# EAGLE design LINUX_ARC at (EAGLE 9.6.2)
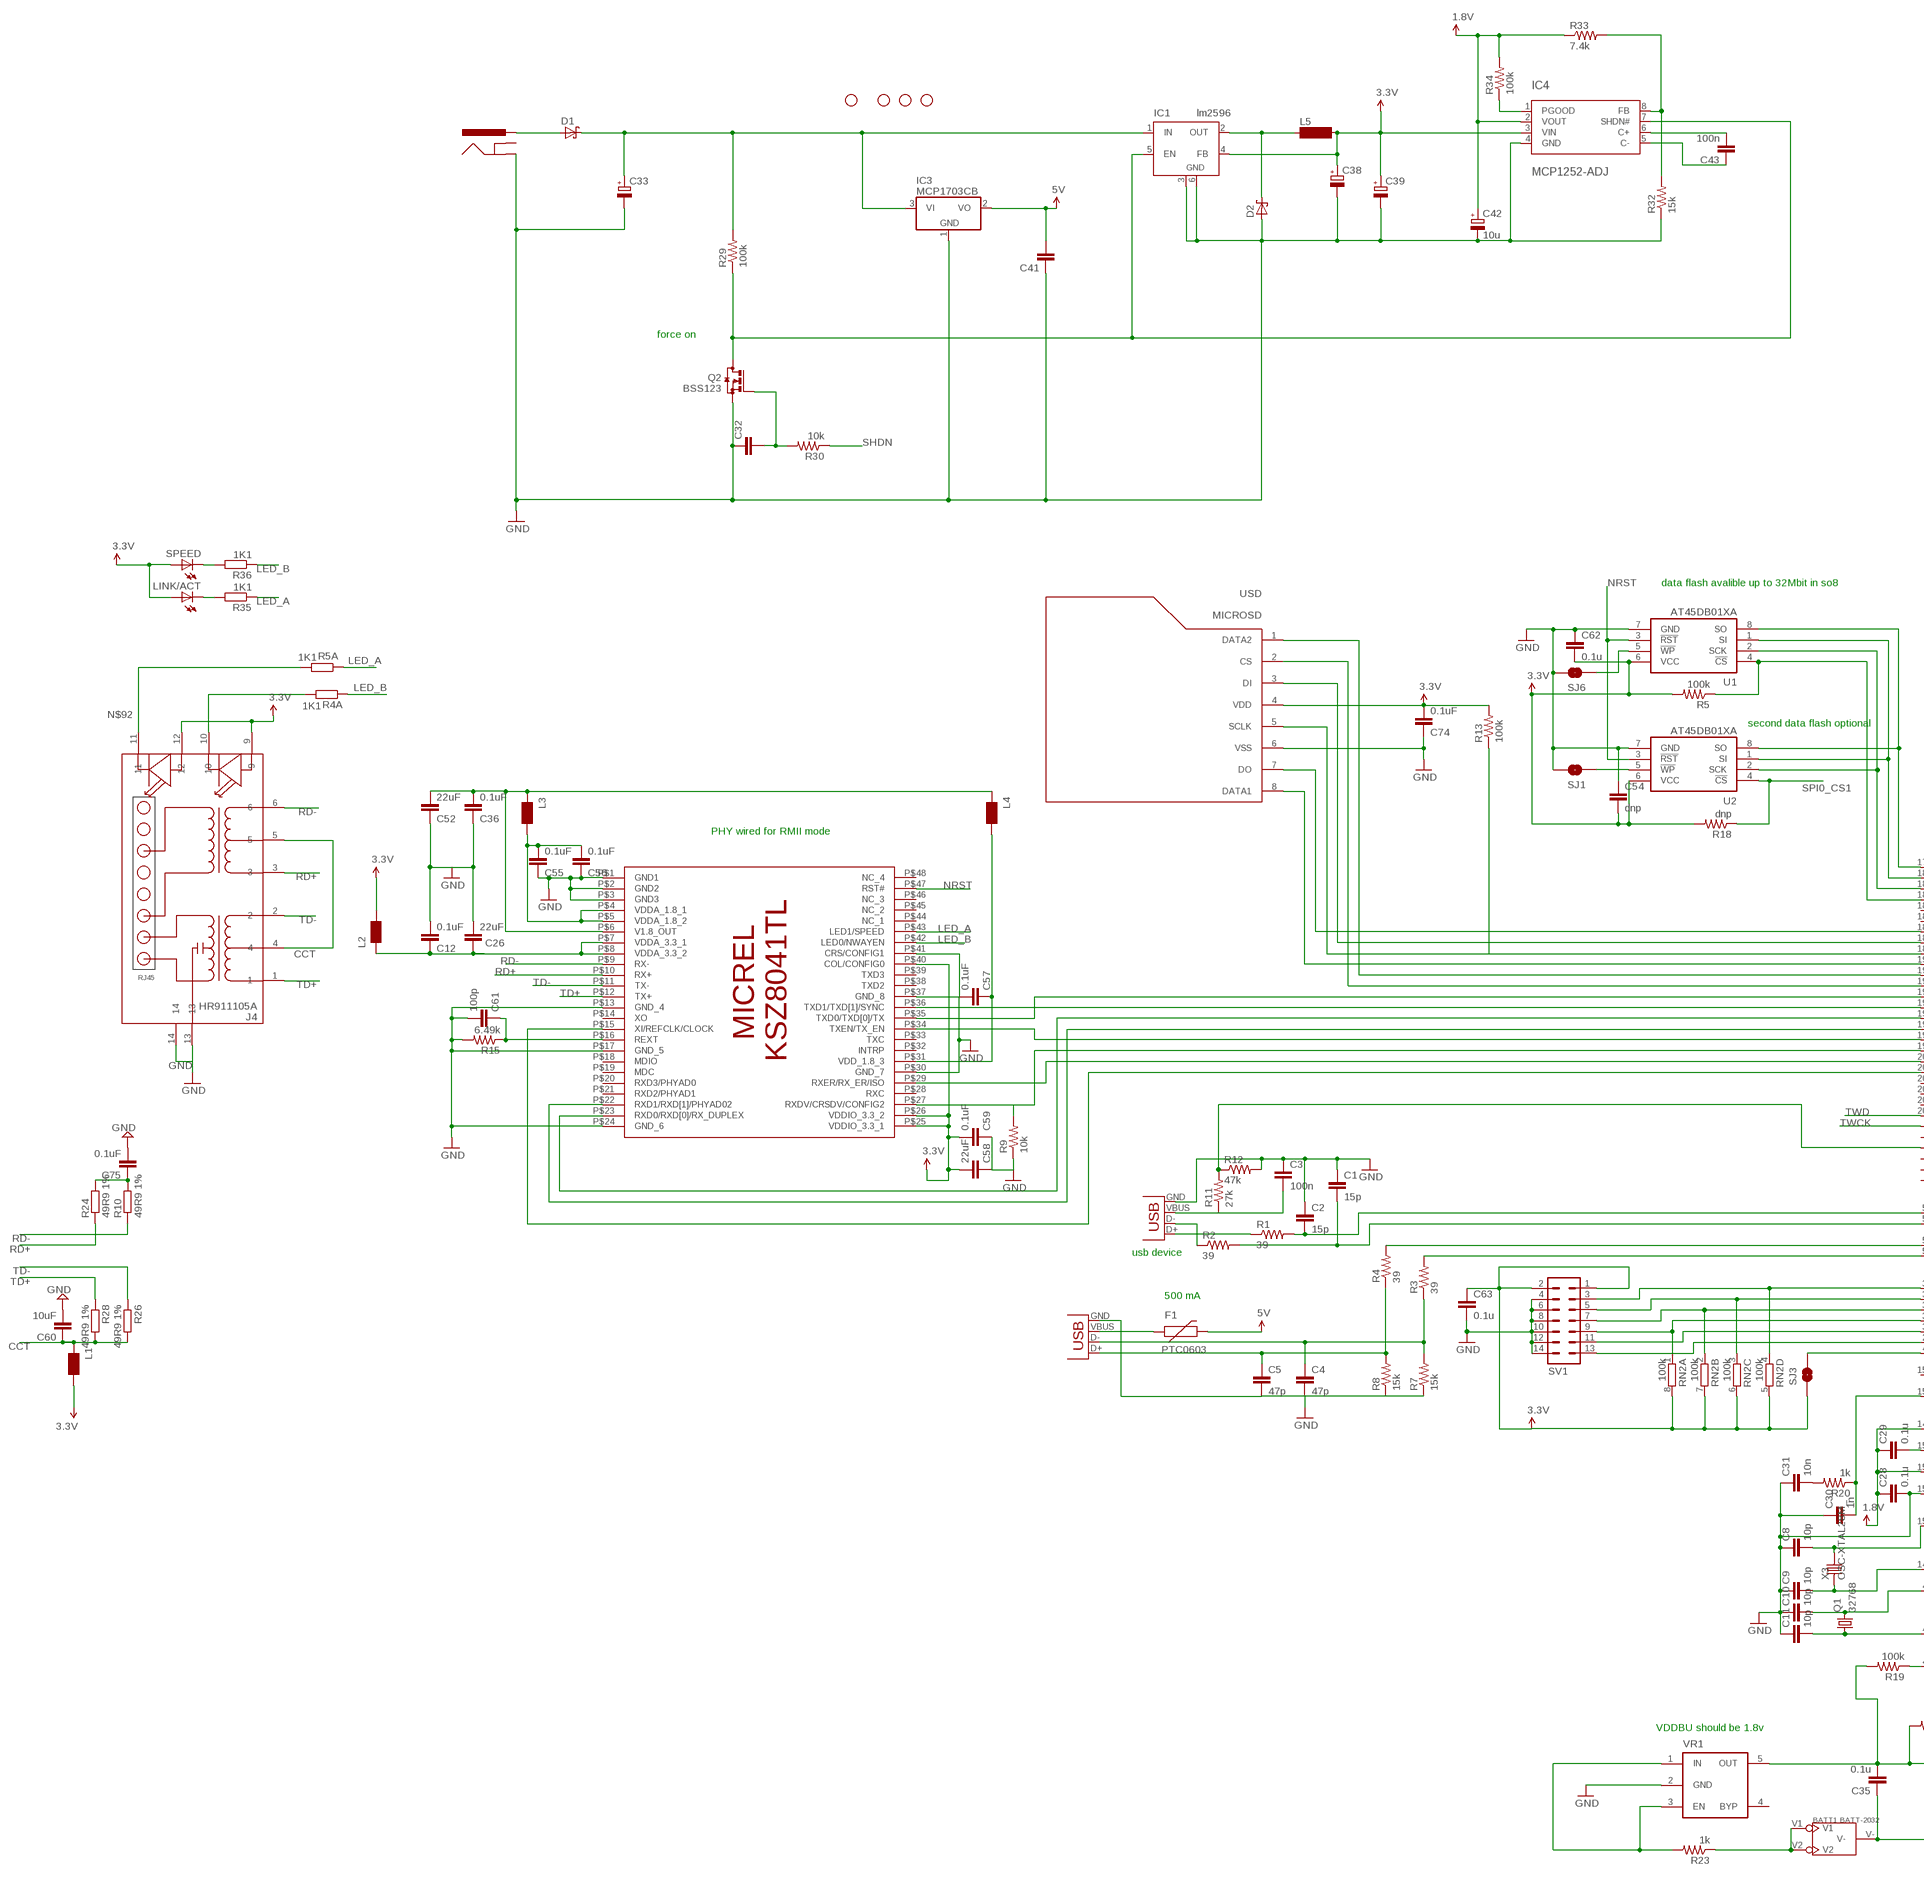
[diagram p0: schematic, sheet 1, part 1 of 2]
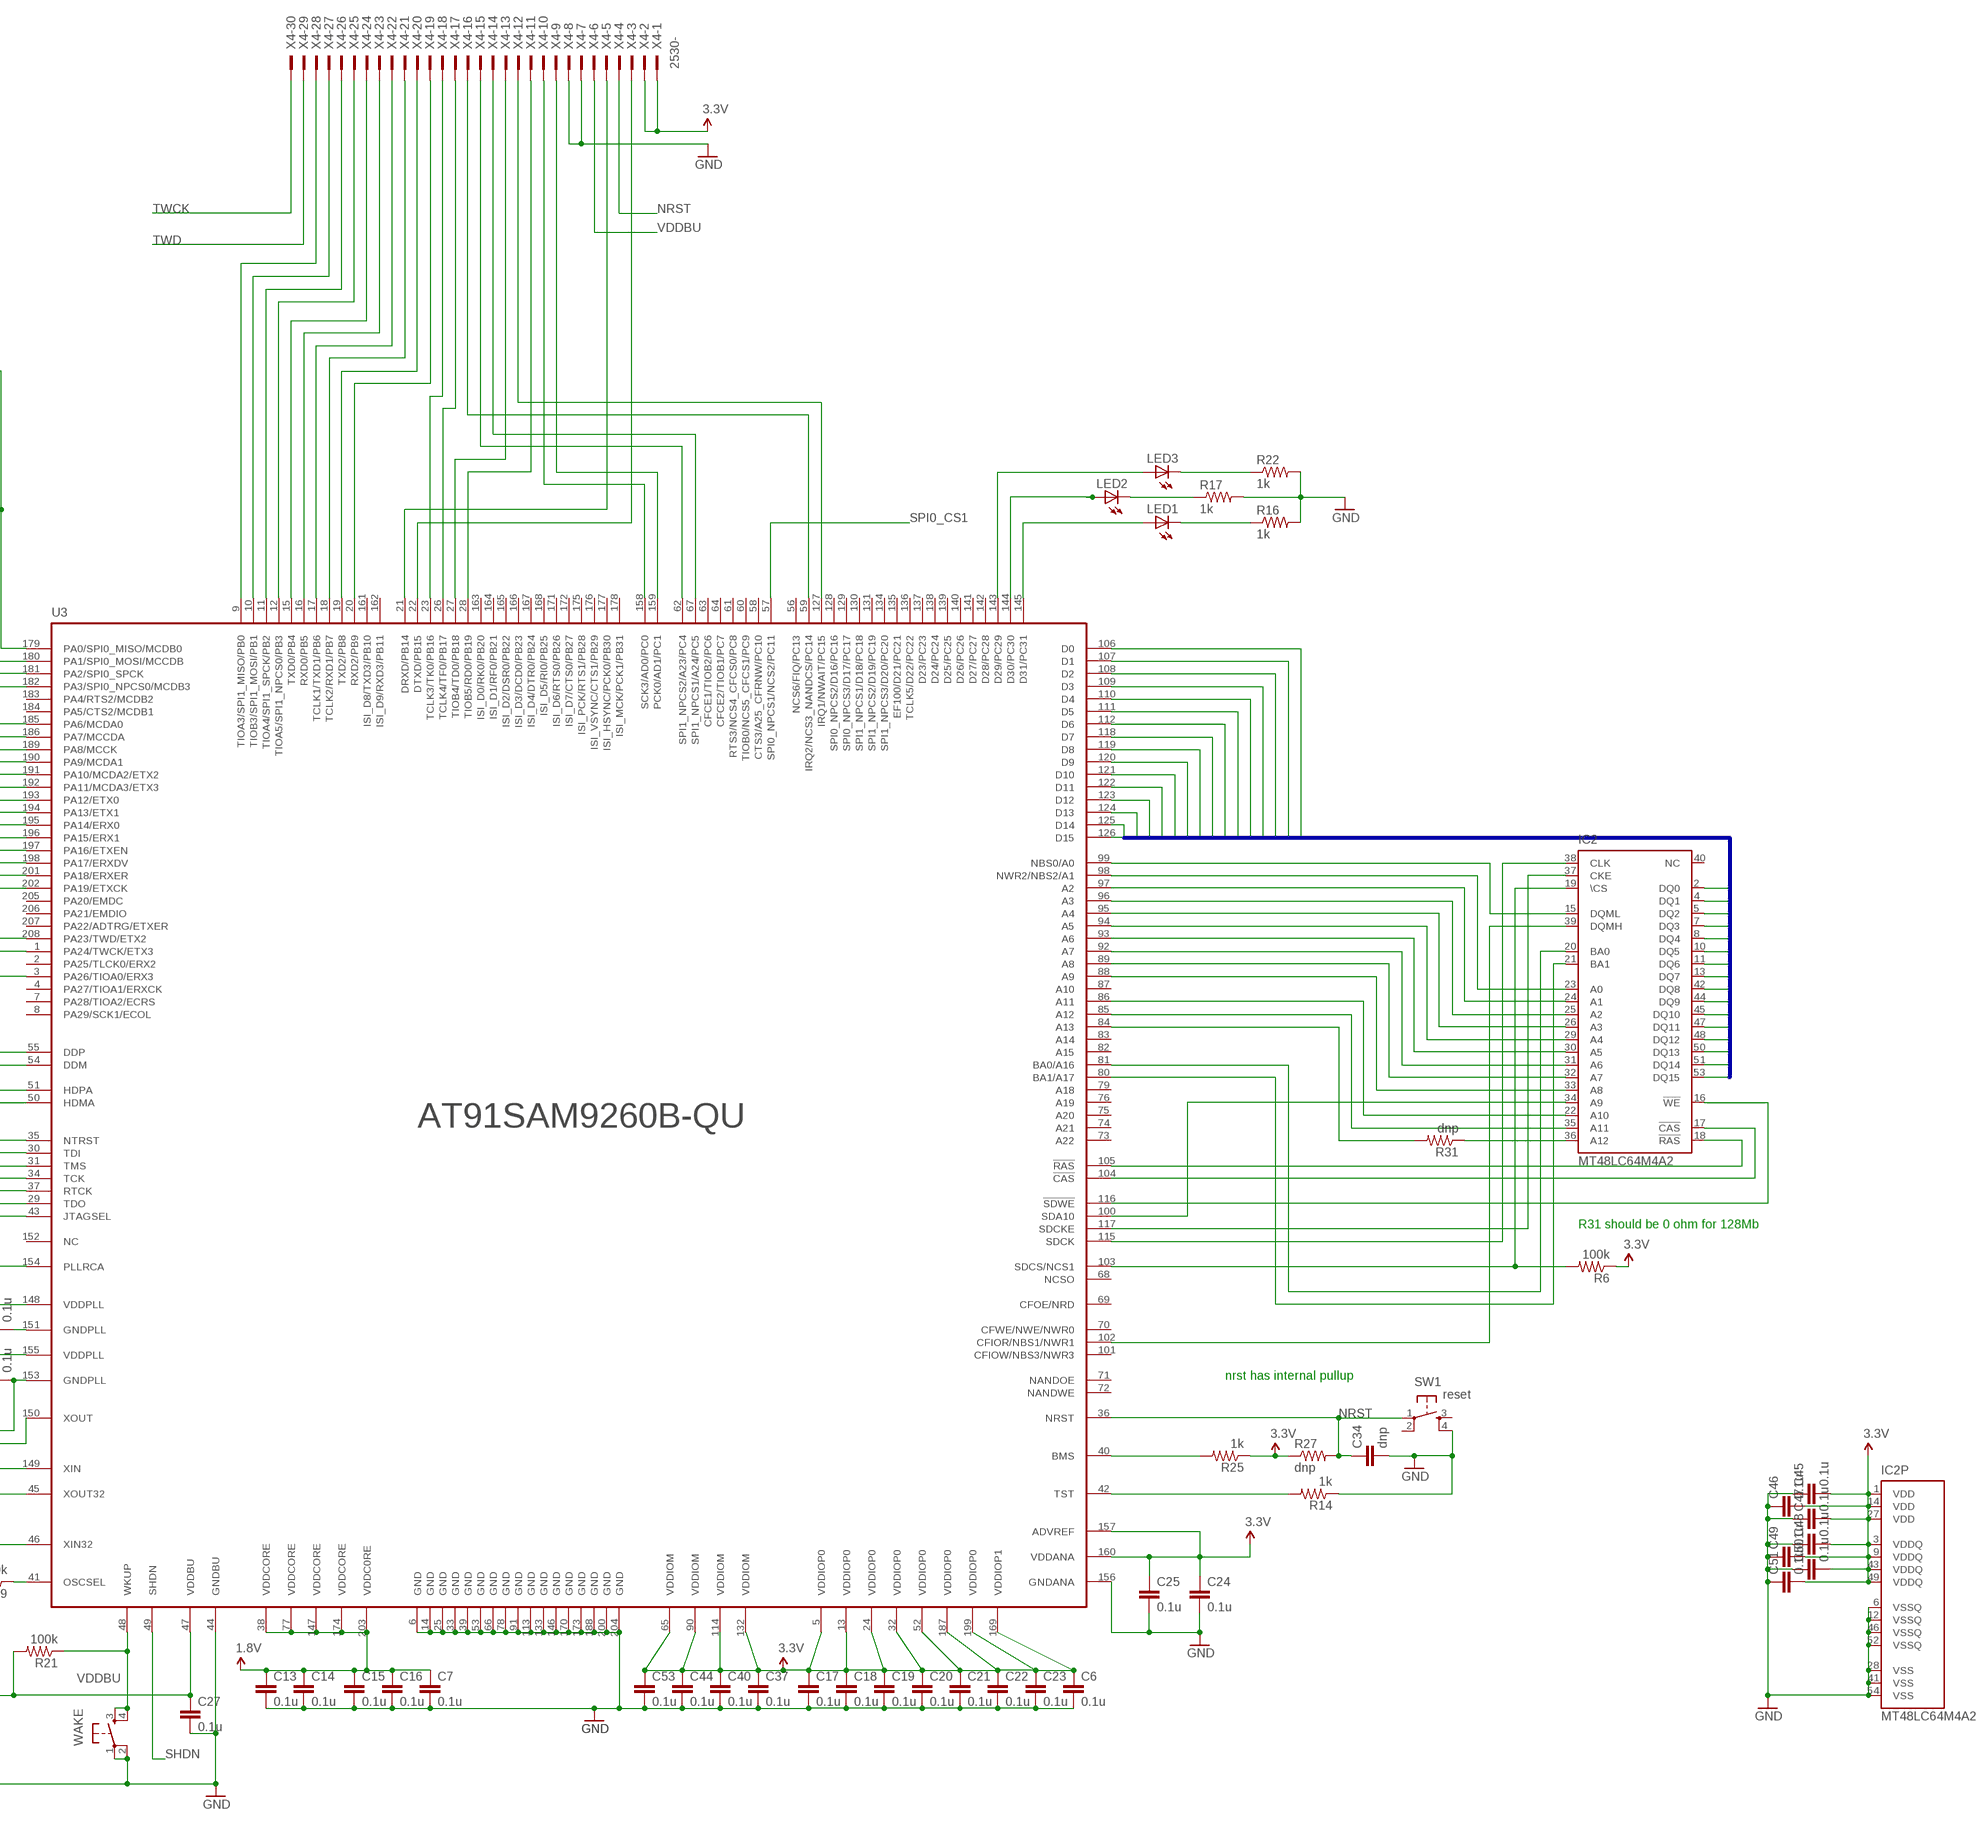
[diagram p1: schematic, sheet 1, part 2 of 2]

## Parts
BATT1  BATT-2032  [2032]
C1  15p  CAP0603-CAP  [0603-CAP]
C2  15p  CAP0603-CAP  [0603-CAP]
C3  100n  CAP0603-CAP  [0603-CAP]
C4  47p  CAP0603-CAP  [0603-CAP]
C5  47p  CAP0603-CAP  [0603-CAP]
C6  0.1u  CAP0603-CAP  [0603-CAP]
C7  0.1u  CAP0603-CAP  [0603-CAP]
C8  10p  CAP0603-CAP  [0603-CAP]
C9  10p  CAP0603-CAP  [0603-CAP]
C10  10p  CAP0603-CAP  [0603-CAP]
C11  10p  CAP0603-CAP  [0603-CAP]
C12  0.1uF  C-EUC0603  [C0603]
C13  0.1u  CAP0603-CAP  [0603-CAP]
C14  0.1u  CAP0603-CAP  [0603-CAP]
C15  0.1u  CAP0603-CAP  [0603-CAP]
C16  0.1u  CAP0603-CAP  [0603-CAP]
C17  0.1u  CAP0603-CAP  [0603-CAP]
C18  0.1u  CAP0603-CAP  [0603-CAP]
C19  0.1u  CAP0603-CAP  [0603-CAP]
C20  0.1u  CAP0603-CAP  [0603-CAP]
C21  0.1u  CAP0603-CAP  [0603-CAP]
C22  0.1u  CAP0603-CAP  [0603-CAP]
C23  0.1u  CAP0603-CAP  [0603-CAP]
C24  0.1u  CAP0603-CAP  [0603-CAP]
C25  0.1u  CAP0603-CAP  [0603-CAP]
C26  22uF  C-EUC0603  [C0603]
C27  0.1u  CAP0603-CAP  [0603-CAP]
C28  0.1u  CAP0603-CAP  [0603-CAP]
C29  0.1u  CAP0603-CAP  [0603-CAP]
C30  1n  CAP0603-CAP  [0603-CAP]
C31  10n  CAP0603-CAP  [0603-CAP]
C32  CAPC603  [C603]
C33  CAP_POLSMC_B  [SMC_B]
C34  dnp  CAP0603-CAP  [0603-CAP]
C35  0.1u  CAP0603-CAP  [0603-CAP]
C36  0.1uF  C-EUC0603  [C0603]
C37  0.1u  CAP0603-CAP  [0603-CAP]
C38  CAP_POLCASE_A  [CASE_A]
C39  CAP_POLSMC_B  [SMC_B]
C40  0.1u  CAP0603-CAP  [0603-CAP]
C41  CAPC603  [C603]
C42  10u  CAP_POLSMC_B  [SMC_B]
C43  100n  CAPC603  [C603]
C44  0.1u  CAP0603-CAP  [0603-CAP]
C45  0.1u  CAP0603-CAP  [0603-CAP]
C46  0.1u  CAP0603-CAP  [0603-CAP]
C47  0.1u  CAP0603-CAP  [0603-CAP]
C48  0.1u  CAP0603-CAP  [0603-CAP]
C49  0.1u  CAP0603-CAP  [0603-CAP]
C50  0.1u  CAP0603-CAP  [0603-CAP]
C51  0.1u  CAP0603-CAP  [0603-CAP]
C52  22uF  C-EUC0603  [C0603]
C53  0.1u  CAP0603-CAP  [0603-CAP]
C54  dnp  CAP0603-CAP  [0603-CAP]
C55  0.1uF  C-EUC0603  [C0603]
C56  0.1uF  C-EUC0603  [C0603]
C57  0.1uF  C-EUC0603  [C0603]
C58  22uF  C-EUC0603  [C0603]
C59  0.1uF  C-EUC0603  [C0603]
C60  10uF  C-EUC0603  [C0603]
C61  100p  C-EUC0603  [C0603]
C62  0.1u  CAP0603-CAP  [0603-CAP]
C63  0.1u  CAP0603-CAP  [0603-CAP]
C74  0.1uF  C-EUC0603  [C0603]
C75  0.1uF  C-EUC0603  [C0603]
D1  SCHOTTKY-DIODESMD  [SMB]
D2  SCHOTTKY-DIODESMD  [SMB]
F1  PTC0603  [0603]
IC1  lm2596  LM2596S  [TO263-5]
IC2  MT48LC64M4A2  [TSOP54-400]
IC3  MCP1703CB  [SOT23]
IC4  MCP1252-ADJ  [MSOP8]
J4  HR911105A  [HR911105A]
JP1  STAND-OFF  [STAND-OFF]
JP2  STAND-OFF  [STAND-OFF]
JP3  STAND-OFF  [STAND-OFF]
JP4  STAND-OFF  [STAND-OFF]
L1  WE-KIL_0805  [WE-KI_0805_B]
L2  WE-KIL_0805  [WE-KI_0805_B]
L3  WE-KIL_0805  [WE-KI_0805_B]
L4  WE-KIL_0805  [WE-KI_0805_B]
L5  MS85  [MS85]
LED1  LEDCHIPLED_0805  [CHIPLED_0805]
LED2  LEDCHIPLED_0805  [CHIPLED_0805]
LED3  LEDCHIPLED_0805  [CHIPLED_0805]
LINK/ACT  LEDCHIPLED_0805  [CHIPLED_0805]
Q1  32768  CRYSTALTC26H  [TC26H]
Q2  BSS123  [SOT23]
R1  39  R-US_R0603  [R0603]
R2  39  R-US_R0603  [R0603]
R3  39  R-US_R0603  [R0603]
R4  39  R-US_R0603  [R0603]
R4A  1K1  R-EU_R0603  [R0603]
R5  100k  R-US_R0603  [R0603]
R5A  1K1  R-EU_R0603  [R0603]
R6  100k  R-US_R0603  [R0603]
R7  15k  R-US_R0603  [R0603]
R8  15k  R-US_R0603  [R0603]
R9  10k  R-US_R0603  [R0603]
R10  49R9 1%  R-EU_R0603  [R0603]
R11  27k  R-US_R0603  [R0603]
R12  47k  R-US_R0603  [R0603]
R13  100k  R-US_R0603  [R0603]
R14  1k  R-US_R0603  [R0603]
R15  6.49k  R-US_R0603  [R0603]
R16  1k  R-US_R0603  [R0603]
R17  1k  R-US_R0603  [R0603]
R18  dnp  R-US_R0603  [R0603]
R19  100k  R-US_R0603  [R0603]
R20  1k  R-US_R0603  [R0603]
R21  100k  R-US_R0603  [R0603]
R22  1k  R-US_R0603  [R0603]
R23  1k  R-US_R0603  [R0603]
R24  49R9 1%  R-EU_R0603  [R0603]
R25  1k  R-US_R0603  [R0603]
R26  49R9 1%  R-EU_R0603  [R0603]
R27  dnp  R-US_R0603  [R0603]
R28  49R9 1%  R-EU_R0603  [R0603]
R29  100k  R-US_R0603  [R0603]
R30  10k  R-US_R0603  [R0603]
R31  dnp  R-US_R0603  [R0603]
R32  15k  R-US_R0603  [R0603]
R33  7.4k  R-US_R0603  [R0603]
R34  100k  R-US_R0603  [R0603]
R35  1K1  R-EU_R0603  [R0603]
R36  1K1  R-EU_R0603  [R0603]
RN2  100k  RNETWORK  [RN8P-4R-CRA06S]
SJ1  SOLDERJUMPERNO  [SJ_2S-NO]
SJ3  SOLDERJUMPERNO  [SJ_2S-NO]
SJ6  SOLDERJUMPERNO  [SJ_2S-NO]
SPEED  LEDCHIPLED_0805  [CHIPLED_0805]
SV1  MA07-2  [MA07-2]
SW1  reset  SW-SMD-SMALL  [TACT_SWITCH_SMALL]
U1  AT45DB01XA  [SO08W]
U2  AT45DB01XA  [SO08W]
U3  AT91SAM9260B-QU  [PQFP208]
U$1  KSZ8041TL  [48PIN-TQFN]
U$2  POWER_JACKSMD  [POWER_JACK_SMD]
USD  MICROSD  [MICROSD]
VR1  MIC5205  [SOT-23-5]
WAKE  SW-SMD-SMALL  [TACT_SWITCH_SMALL]
X1  USB-MB-S  [USB-MB-S]
X2  USB-A-H  [USB-A-H]
X3  OSC-XTAL28M_  [5X8]
X4  2530-  [PAK100/2500-30]

## Nets
1.8V: C7.1 C13.1 C14.1 C15.1 C16.1 C28.1 C29.1 C42.+ R33.1 R34.2 U3.38(VDDCORE) U3.77(VDDCORE) U3.147(VDDCORE) U3.148(VDDPLL) U3.155(VDDPLL) U3.174(VDDCORE) U3.203(VDDC0RE)
3.3V: C6.1 C17.1 C18.1 C19.1 C20.1 C21.1 C22.1 C23.1 C24.1 C25.1 C37.1 C38.+ C39.+ C40.1 C44.1 C45.2 C46.2 C47.2 C48.2 C49.2 C50.2 C51.2 C53.1 C54.2 C58.1 C59.1 C62.2 C63.1 C74.1 IC1.4(FB) IC2.1(VDD) IC2.3(VDDQ) IC2.9(VDDQ) IC2.14(VDD) IC2.27(VDD) IC2.43(VDDQ) IC2.49(VDDQ) IC4.3(VIN) J4.9 J4.12 L1.1 L2.1 L5.2 LINK/ACT.A R5.2 R6.1 R13.2 R18.2 R25.1 R27.1 RN2.5 RN2.6 RN2.7 RN2.8 SJ3.1 SPEED.A SV1.1 SV1.2 U1.6(VCC) U2.6(VCC) U3.5(VDDIOP0) U3.13(VDDIOP0) U3.24(VDDIOP0) U3.32(VDDIOP0) U3.52(VDDIOP0) U3.65(VDDIOM) U3.90(VDDIOM) U3.114(VDDIOM) U3.132(VDDIOM) U3.157(ADVREF) U3.160(VDDANA) U3.169(VDDIOP1) U3.187(VDDIOP0) U3.199(VDDIOP0) U$1.P$25(VDDIO_3.3_1) U$1.P$26(VDDIO_3.3_2) U$1.P$40(COL/CONFIG0) USD.4(VDD) X4.1 X4.2
5V: C41.2 F1.2 IC3.2(VO)
CCT: C60.1 J4.4 J4.5 L1.2 R26.2 R28.2
D0: IC2.2(DQ0) U3.106(D0)
D1: IC2.4(DQ1) U3.107(D1)
D2: IC2.5(DQ2) U3.108(D2)
D3: IC2.7(DQ3) U3.109(D3)
D4: IC2.8(DQ4) U3.110(D4)
D5: IC2.10(DQ5) U3.111(D5)
D6: IC2.11(DQ6) U3.112(D6)
D7: IC2.13(DQ7) U3.118(D7)
D8: IC2.42(DQ8) U3.119(D8)
D9: IC2.44(DQ9) U3.120(D9)
D10: IC2.45(DQ10) U3.121(D10)
D11: IC2.47(DQ11) U3.122(D11)
D12: IC2.48(DQ12) U3.123(D12)
D13: IC2.50(DQ13) U3.124(D13)
D14: IC2.51(DQ14) U3.125(D14)
D15: IC2.53(DQ15) U3.126(D15)
GND: BATT1.V- C1.1 C2.1 C3.1 C4.2 C5.2 C6.2 C7.2 C8.1 C9.1 C10.1 C11.1 C12.1 C13.2 C14.2 C15.2 C16.2 C17.2 C18.2 C19.2 C20.2 C21.2 C22.2 C23.2 C24.2 C25.2 C26.1 C27.2 C28.2 C30.1 C31.1 C32.1 C33.- C34.2 C35.1 C36.2 C37.2 C38.- C39.- C40.2 C41.1 C42.- C44.2 C45.1 C46.1 C47.1 C48.1 C49.1 C50.1 C51.1 C52.2 C53.2 C54.1 C55.2 C56.2 C57.1 C58.2 C59.2 C60.2 C61.1 C62.1 C63.2 C74.2 C75.2 D2.A IC1.3(GND) IC1.6(GND) IC2.6(VSSQ) IC2.12(VSSQ) IC2.28(VSS) IC2.41(VSS) IC2.46(VSSQ) IC2.52(VSSQ) IC2.54(VSS) IC3.1(GND) IC4.4(GND) J4.13 J4.14 Q2.2(S) R7.1 R8.1 R9.1 R12.2 R14.1 R15.2 R16.2 R17.2 R22.2 R32.1 SJ1.2 SJ6.2 SV1.4 SV1.6 SV1.8 SV1.10 SV1.12 SV1.14 SW1.4 U1.7(GND) U2.7(GND) U3.6(GND) U3.14(GND) U3.25(GND) U3.33(GND) U3.39(GND) U3.44(GNDBU) U3.53(GND) U3.66(GND) U3.78(GND) U3.91(GND) U3.113(GND) U3.133(GND) U3.146(GND) U3.153(GNDPLL) U3.156(GNDANA) U3.170(GND) U3.173(GND) U3.188(GND) U3.200(GND) U3.204(GND) U$1.P$1(GND1) U$1.P$2(GND2) U$1.P$3(GND3) U$1.P$13(GND_4) U$1.P$17(GND_5) U$1.P$24(GND_6) U$1.P$30(GND_7) U$1.P$37(GND_8) U$1.P$41(CRS/CONFIG1) U$2.P$4(GND) USD.6(VSS) VR1.2(GND) WAKE.1 WAKE.2 X1.GND X2.GND X4.7 X4.8
LED_A: R5A.1 R35.1 U$1.P$43(LED1/SPEED)
LED_B: R4A.1 R36.1 U$1.P$42(LED0/NWAYEN)
LED_SPEED: J4.10 R4A.2
N$1: RN2.4 SV1.3 U3.35(NTRST)
N$2: C10.2 Q1.2 U3.45(XOUT32)
N$3: C11.2 Q1.1 U3.46(XIN32)
N$4: C9.2 U3.149(XIN) X3.1(X1)
N$5: C8.2 U3.150(XOUT) X3.2(X2)
N$6: C29.2 U3.151(GNDPLL)
N$7: IC2.18(!RAS) U3.105(!RAS)
N$8: IC2.17(!CAS) U3.104(!CAS)
N$9: IC2.16(!WE) U3.116(!SDWE)
N$10: IC2.15(DQML) U3.99(NBS0/A0)
N$11: IC2.23(A0) U3.98(NWR2/NBS2/A1)
N$12: IC2.24(A1) U3.97(A2)
N$29: IC2.20(BA0) U3.81(BA0/A16)
N$30: IC2.21(BA1) U3.80(BA1/A17)
N$31: IC2.38(CLK) U3.115(SDCK)
N$32: IC2.25(A2) U3.96(A3)
N$33: IC2.26(A3) U3.95(A4)
N$34: C4.1 R3.1 R7.2 U3.191(PA10/MCDA2/ETX2) USD.1(DATA2) X2.D-
N$35: C5.1 R4.1 R8.2 X2.D+
N$36: R4.2 U3.51(HDPA)
N$37: SJ3.2 U3.43(JTAGSEL)
N$38: R3.2 U3.50(HDMA)
N$39: U1.2(SCK) U2.2(SCK) U3.181(PA2/SPI0_SPCK)
N$40: IC1.5(EN) IC4.7(SHDN#) Q2.3(D) R29.1
N$41: U1.1(SI) U2.1(SI) U3.180(PA1/SPI0_MOSI/MCCDB)
N$42: C61.2 R15.1 U$1.P$16(REXT)
N$43: U3.23(TCLK3/TK0/PB16) X4.18
N$44: U3.26(TCLK4/TF0/PB17) X4.17
N$45: U1.8(SO) U2.8(SO) U3.179(PA0/SPI0_MISO/MCDB0)
N$46: U3.9(TIOA3/SPI1_MISO/PB0) X4.28
N$47: SV1.11 U3.37(RTCK)
N$48: RN2.3 SV1.5 U3.30(TDI)
N$49: RN2.2 SV1.7 U3.31(TMS)
N$50: RN2.1 SV1.9 U3.34(TCK)
N$51: SJ1.1 U2.5(!WP!)
N$52: U3.27(TIOB4/TD0/PB18) X4.13
N$53: IC2.29(A4) U3.94(A5)
N$54: IC2.30(A5) U3.93(A6)
N$55: IC2.31(A6) U3.92(A7)
N$56: IC2.32(A7) U3.89(A8)
N$57: IC2.33(A8) U3.88(A9)
N$58: IC2.34(A9) U3.100(SDA10)
N$59: IC2.22(A10) U3.86(A11)
N$60: IC2.35(A11) U3.85(A12)
N$61: R31.2 U3.84(A13)
N$62: IC2.36(A12) R31.1
N$63: R19.1 U3.41(OSCSEL)
N$64: R5.1 U1.4(!CS!) U3.182(PA3/SPI0_NPCS0/MCDB3)
N$65: U3.28(TIOB5/RD0/PB19) X4.11
N$66: C75.1 R10.2 R24.2
N$67: C12.2 C26.2 L2.2 U$1.P$7(VDDA_3.3_1) U$1.P$8(VDDA_3.3_2)
N$68: C32.2 Q2.1(G) R30.2
N$69: U3.202(PA19/ETXCK) U$1.P$15(XI/REFCLK/CLOCK)
N$70: R9.2 U3.198(PA17/ERXDV) U$1.P$27(RXDV/CRSDV/CONFIG2)
N$71: IC2.39(DQMH) U3.102(CFIOR/NBS1/NWR1)
N$72: U3.195(PA14/ERX0) U$1.P$23(RXD0/RXD[0]/RX_DUPLEX)
N$73: U3.196(PA15/ERX1) U$1.P$22(RXD1/RXD[1]/PHYAD02)
N$74: U3.201(PA18/ERXER) U$1.P$29(RXER/RX_ER/ISO)
N$75: SJ6.1 U1.5(!WP!)
N$76: U3.197(PA16/ETXEN) U$1.P$34(TXEN/TX_EN)
N$77: U3.193(PA12/ETX0) U$1.P$35(TXD0/TXD[0]/TX)
N$78: U3.194(PA13/ETX1) U$1.P$36(TXD1/TXD[1]/SYNC)
N$79: R25.2 U3.40(BMS)
N$80: LED3.A U3.143(D29/PC29)
N$81: R36.2 SPEED.C
N$82: U3.10(TIOB3/SPI1_MOSI/PB1) X4.27
N$83: R14.2 U3.42(TST)
N$84: IC2.19(\CS) R6.2 U3.103(SDCS/NCS1)
N$85: IC2.37(CKE) U3.117(SDCKE)
N$86: C55.1 C56.1 L3.1 U$1.P$4(VDDA_1.8_1) U$1.P$5(VDDA_1.8_2)
N$87: C57.2 L4.1 U$1.P$31(VDD_1.8_3)
N$88: LINK/ACT.C R35.2
N$89: C36.1 C52.1 L3.2 L4.2 U$1.P$6(V1.8_OUT)
N$90: LED2.A U3.144(D30/PC30)
N$91: R23.2 VR1.1(IN) VR1.3(EN)
N$92: J4.11 R5A.2
N$94: LED1.A U3.145(D31/PC31)
N$95: LED1.C R16.1
N$96: C1.2 R2.2 U3.54(DDM)
N$97: C2.2 R1.2 U3.55(DDP)
N$98: LED2.C R17.1
N$99: R2.1 X1.D-
N$100: R1.1 X1.D+
N$101: LED3.C R22.1
N$102: C3.2 R11.1 X1.VBUS
N$103: U3.11(TIOA4/SPI1_SPCK/PB2) X4.26
N$104: U3.12(TIOA5/SPI1_NPCS0/PB3) X4.25
N$105: C33.+ D1.C IC1.1(IN) IC3.3(VI) R29.2
N$106: BATT1.V1 BATT1.V2 R23.1
N$107: U3.190(PA9/MCDA1) USD.8(DATA1)
N$108: U3.15(TXD0/PB4) X4.24
N$109: U3.16(RXD0/PB5) X4.23
N$110: U3.17(TCLK1/TXD1/PB6) X4.22
N$111: U3.18(TCLK2/RXD1/PB7) X4.21
N$112: U3.19(TXD2/PB8) X4.20
N$113: U3.20(RXD2/PB9) X4.19
N$114: U3.158(SCK3/AD0/PC0) X4.10
N$115: U3.159(PCK0/AD1/PC1) X4.9
N$116: U3.21(DRXD/PB14) X4.5
N$117: U3.22(DTXD/PB15) X4.3
N$118: U3.62(SPI1_NPCS2/A23/PC4) X4.15
N$119: C31.2 R20.2
N$120: C30.2 R20.1 U3.154(PLLRCA)
N$121: F1.1 X2.VBUS
N$122: U3.67(SPI1_NPCS1/A24/PC5) X4.14
N$123: U3.59(IRQ2/NCS3_NANDCS/PC14) X4.16
N$124: U3.127(IRQ1/NWAIT/PC15) X4.12
N$125: SV1.13 U3.29(TDO)
N$126: D1.A U$2.VIN0(PWR)
N$127: D2.C IC1.2(OUT) L5.1
N$130: C43.2 IC4.6(C+)
N$131: C43.1 IC4.5(C-)
N$132: IC4.8(FB) R32.2 R33.2
N$134: IC4.1(PGOOD) R34.1
N$164: R21.1 U3.48(WKUP) WAKE.3 WAKE.4
NRST: C34.1 R27.2 SW1.1 U1.3(!RST!) U2.3(!RST!) U3.36(NRST) U$1.P$47(RST#) X4.4
RD+: J4.3 R24.1 U$1.P$10(RX+)
RD-: J4.6 R10.1 U$1.P$9(RX-)
SDCLK: R13.1 U3.189(PA8/MCCK) USD.5(SCLK)
SDCS: U3.192(PA11/MCDA3/ETX3) USD.2(CS)
SDMISO: U3.185(PA6/MCDA0) USD.7(DO)
SDMOSI: U3.186(PA7/MCCDA) USD.3(DI)
SHDN: R30.1 U3.49(SHDN)
SPI0_CS1: R18.1 U2.4(!CS!) U3.57(SPI0_NPCS1/NCS2/PC11)
TD+: J4.1 R28.1 U$1.P$12(TX+)
TD-: J4.2 R26.1 U$1.P$11(TX-)
TWCK: U3.1(PA24/TWCK/ETX3) X4.30
TWD: U3.208(PA23/TWD/ETX2) X4.29
USBDETECT: R11.2 R12.1 U3.3(PA26/TIOA0/ERX3)
VDDBU: C27.1 C35.2 R19.2 R21.2 U3.47(VDDBU) VR1.5(OUT) X4.6
Unconnected: IC2.40(NC) IC4.2(VOUT) SW1.2 SW1.3 U3.2(PA25/TLCK0/ERX2) U3.4(PA27/TIOA1/ERXCK) U3.7(PA28/TIOA2/ECRS) U3.8(PA29/SCK1/ECOL) U3.56(NCS6/FIQ/PC13) U3.58(CTS3/A25_CFRNW/PC10) U3.60(TIOB0/NCS5_CFCS1/PC9) U3.61(RTS3/NCS4_CFCS0/PC8) U3.63(CFCE1/TIOB2/PC6) U3.64(CFCE2/TIOB1/PC7) U3.68(NCSO) U3.69(CFOE/NRD) U3.70(CFWE/NWE/NWR0) U3.71(NANDOE) U3.72(NANDWE) U3.73(A22) U3.74(A21) U3.75(A20) U3.76(A19) U3.79(A18) U3.82(A15) U3.83(A14) U3.87(A10) U3.101(CFIOW/NBS3/NWR3) U3.128(SPI0_NPCS2/D16/PC16) U3.129(SPI0_NPCS3/D17/PC17) U3.130(SPI1_NPCS1/D18/PC18) U3.131(SPI1_NPCS2/D19/PC19) U3.134(SPI1_NPCS3/D20/PC20) U3.135(EF100/D21/PC21) U3.136(TCLK5/D22/PC22) U3.137(D23/PC23) U3.138(D24/PC24) U3.139(D25/PC25) U3.140(D26/PC26) U3.141(D27/PC27) U3.142(D28/PC28) U3.152(NC) U3.161(ISI_D8/TXD3/PB10) U3.162(ISI_D9/RXD3/PB11) U3.163(ISI_D0/RK0/PB20) U3.164(ISI_D1/RF0/PB21) U3.165(ISI_D2/DSR0/PB22) U3.166(ISI_D3/DCD0/PB23) U3.167(ISI_D4/DTR0/PB24) U3.168(ISI_D5/RI0/PB25) U3.171(ISI_D6/RTS0/PB26) U3.172(ISI_D7/CTS0/PB27) U3.175(ISI_PCK/RTS1/PB28) U3.176(ISI_VSYNC/CTS1/PB29) U3.177(ISI_HSYNC/PCK0/PB30) U3.178(ISI_MCK/PCK1/PB31) U3.183(PA4/RTS2/MCDB2) U3.184(PA5/CTS2/MCDB1) U3.205(PA20/EMDC) U3.206(PA21/EMDIO) U3.207(PA22/ADTRG/ETXER) U$1.P$14(XO) U$1.P$18(MDIO) U$1.P$19(MDC) U$1.P$20(RXD3/PHYAD0) U$1.P$21(RXD2/PHYAD1) U$1.P$28(RXC) U$1.P$32(INTRP) U$1.P$33(TXC) U$1.P$38(TXD2) U$1.P$39(TXD3) U$1.P$44(NC_1) U$1.P$45(NC_2) U$1.P$46(NC_3) U$1.P$48(NC_4) U$2.GND VR1.4(BYP)

## Buses
D[0..15]

## Notes on the sheet
- force on
- data flash avalible up to 32Mbit in so8
- second data flash optional
- PHY wired for RMII mode
- usb device
- 500 mA
- R31 should be 0 ohm for 128Mb
- nrst has internal pullup
- VDDBU should be 1.8v

## Library data of the parts
BATT1 = dp_devices:BATT-2032
C1-C11 C13-C25 C27-C31 C34 C35 C37 C40 C44-C51 C53 C54 C62 C63 = SparkFun:CAP: Capacitor Standard 0603 ceramic capacitor, and 0.1" leaded capacitor.
C12 C26 C36 C52 C55-C61 C74 C75 = rcl:C-EU: CAPACITOR, European symbol
C32 C41 C43 = dp_devices:CAP
C33 C38 C39 C42 = dp_devices:CAP_POL
D1 D2 = diode:SCHOTTKY-DIODE: Schottky Diode
F1 = SparkFun:PTC: Resettable Fuse PTC Resettable Fuse. Spark Fun Electronics SKU : COM-08357
IC1 = linear:LM2596S: STEP-DOWN VOLTAGE REGULATOR
IC2 = memory-micron:MT48LC64M4A2: 256Mb: x16 SDRAM MT48LC64M4A2 - 16 Meg x 4 x 4 banks Source: http://download.micron.com/pdf/datasheets/dram/sdram/256MSDRAM.pdf
IC3 = linear:MCP1703: 250 mA, 16V, Low Quiescent Current LDO Regulator Source: http://ww1.microchip.com/downloads/en/DeviceDoc/22049b.pdf
IC4 = microchip-dspic:MCP1252-ADJ: Positive-Regulated Adjustable Charge Pump
J4 = CONNECTER:HR911105A
JP1-JP4 = SparkFun:STAND-OFF: Stand Off This is the mechanical footprint for a #4 phillips button head screw. Use the keepout ring to avoid running the screw head into surrounding components. SKU : PRT-00447
L1-L4 = wuerth-elektronik:WE-KIL: SMD Wire Wound Ceramic Inductor WE-KIL - Low profile - High Q values -- Bluetooth -- Wireless LAN -- RF oscillation circuit -- IF impedance matching
L5 = inductor-neosid:MS85: INDUCTOR SMD power inductor
LED1-LED3 LINK/ACT SPEED = led:LED: LED OSRAM: - CHIPLED LG R971, LG N971, LY N971, LG Q971, LY Q971, LO R971, LY R971 LH N974, LH R974 LS Q976, LO Q976, LY Q976 LO Q996 - Hyper CHIPLED LW Q18S LB Q993, LB Q99A, LB R99A - SideLED LS A670, LO A670, LY A670, LG A670, LP A670 LB A673, LV A673, LT A673, LW A673 LH A674 LY A675 LS A676, LA A676, LO A676, LY A676, LW A676 LS A679, LY A679, LG A679 - Hyper Micro SIDELED® LS Y876, LA Y876, LO Y876, LY Y876 LT Y87S - SmartLED LW L88C, LW L88S LB L89C, LB L89S, LG L890 LS L89K, LO L89K, LY L89K LS L896, LA L896, LO L896, LY L896 - TOPLED LS T670, LO T670, LY T670, LG T670, LP T670 LSG T670, LSP T670, LSY T670, LOP T670, LYG T670 LG T671, LOG T671, LSG T671 LB T673, LV T673, LT T673, LW T673 LH T674 LS T676, LA T676, LO T676, LY T676, LB T676, LH T676, LSB T676, LW T676 LB T67C, LV T67C, LT T67C, LS T67K, LO T67K, LY T67K, LW E67C LS E67B, LA E67B, LO E67B, LY E67B, LB E67C, LV E67C, LT E67C LW T67C LS T679, LY T679, LG T679 LS T770, LO T770, LY T770, LG T770, LP T770 LB T773, LV T773, LT T773, LW T773 LH T774 LS E675, LA E675, LY E675, LS T675 LS T776, LA T776, LO T776, LY T776, LB T776 LHGB T686 LT T68C, LB T68C - Hyper Mini TOPLED® LB M676 - Mini TOPLED Santana® LG M470 LS M47K, LO M47K, LY M47K Source: http://www.osram.convergy.de LUXEON: - LUMILED® LXK2-PW12-R00, LXK2-PW12-S00, LXK2-PW14-U00, LXK2-PW14-V00 LXK2-PM12-R00, LXK2-PM12-S00, LXK2-PM14-U00 LXK2-PE12-Q00, LXK2-PE12-R00, LXK2-PE12-S00, LXK2-PE14-T00, LXK2-PE14-U00 LXK2-PB12-K00, LXK2-PB12-L00, LXK2-PB12-M00, LXK2-PB14-N00, LXK2-PB14-P00, LXK2-PB14-Q00 LXK2-PR12-L00, LXK2-PR12-M00, LXK2-PR14-Q00, LXK2-PR14-R00 LXK2-PD12-Q00, LXK2-PD12-R00, LXK2-PD12-S00 LXK2-PH12-R00, LXK2-PH12-S00 LXK2-PL12-P00, LXK2-PL12-Q00, LXK2-PL12-R00 Source: www.luxeon.com KINGBRIGHT: KA-3528ASYC Source: www.kingbright.com
Q1 = crystal:CRYSTAL: CRYSTAL
Q2 = transistor-small-signal:BSS123: N-CHANNEL MOS FET
R1-R9 R11-R23 R25 R27 R29-R34 = resistor:R-US_: RESISTOR, American symbol
R4A R5A R10 R24 R26 R28 R35 R36 = rcl:R-EU_: RESISTOR, European symbol
RN2 = dp_devices:RNETWORK: 4 Resistor Array 0603
SJ1 SJ3 SJ6 = SparkFun:SOLDERJUMPER: Solder Jumper Standard SMD solder jumper. Used to automate production. Two varients : Normally Open and Normally Closed are the same, but have different paste layers. NC will have a large amount of paste and should jumper during reflow.
SV1 = con-lstb:MA07-2: PIN HEADER
SW1 WAKE = dp_devices:SW-SMD-SMALL
U1 U2 = memory-atmel:AT45DB01X: EEPROM SPI bus serial
U3 = atmel-arm:AT91SAM9260B-QU: AT91SAM9260 MCU AT91 ARM-9 Thumb Microcontroller
U$1 = micrelphy:KSZ8041TL
U$2 = SparkFun-3-2-07:POWER_JACK: Power Jack This is the standard 5.5mm barrel jack for power. The PTH is the most common, proven, reliable, footprint. All others are experimental. The Slot footprint only works if the mill layer is transmitted to the PCB fab house so be warned. Spark Fun Electronics SKU : PType-BPJ. Mating wall wart : Tools-PS
USD = Seeed:MICROSD
VR1 = dp_devices:MIC5205: 150ma Low-Noise LDO Regulator
X1 X2 = con-usb:USB: USB Connectors
X3 = dp_devices:OSC-XTAL2
X4 = con-3m:2530-: 3M (TM) Pak 100 4-Wall Header Source: 3M

## Board
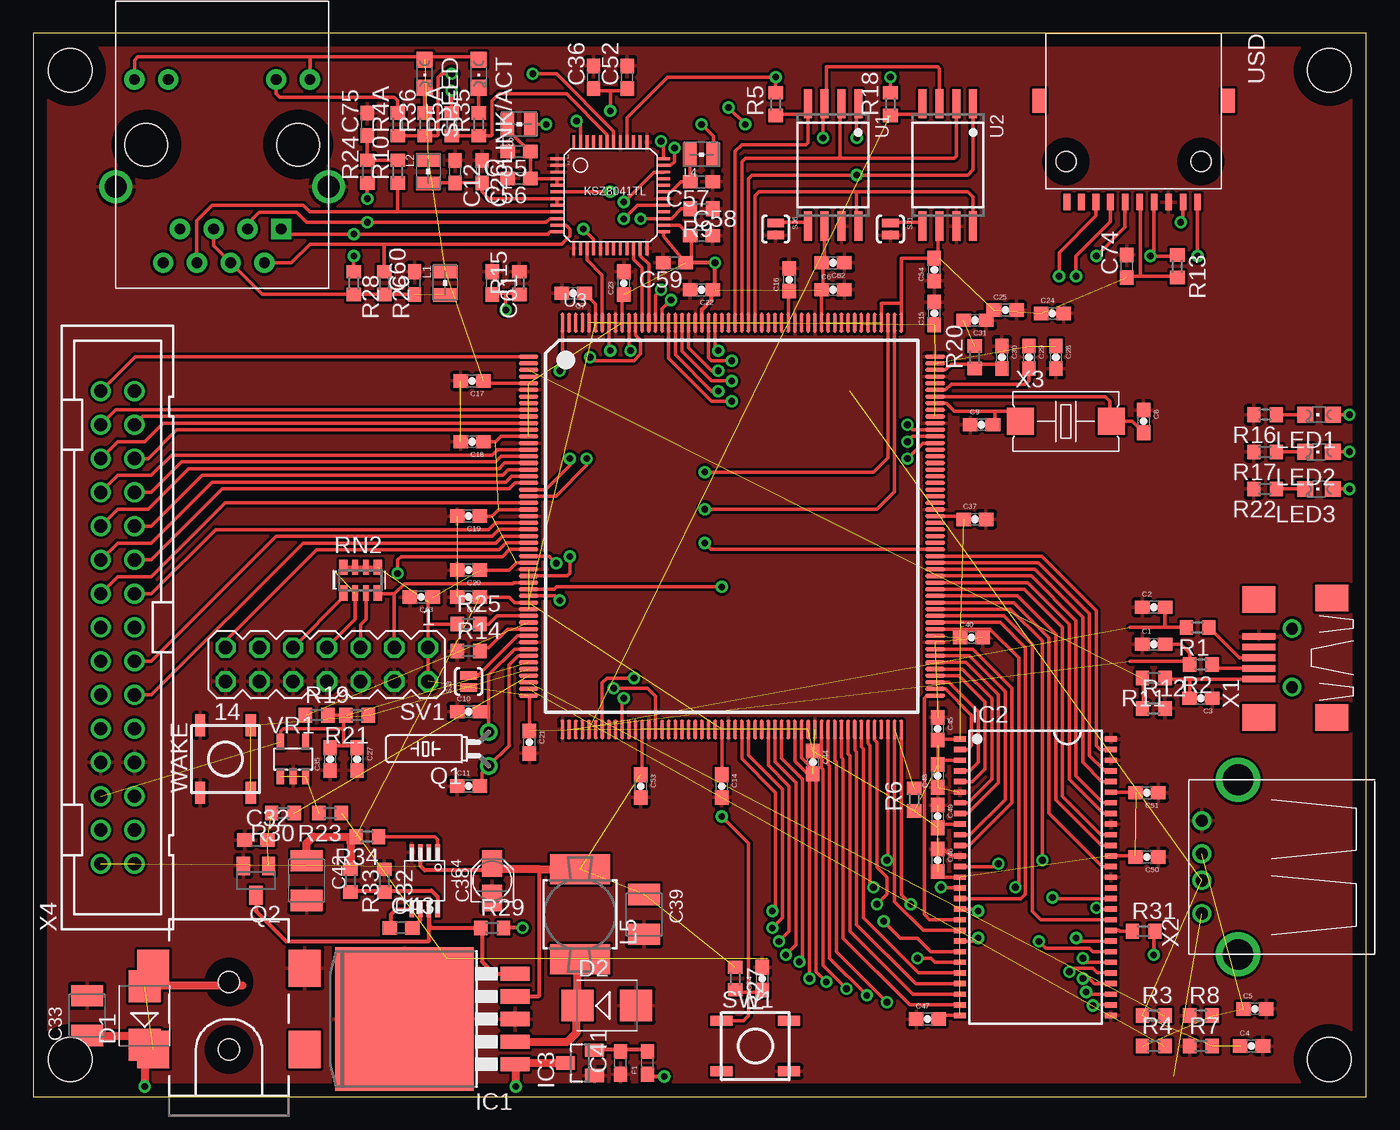
[diagram p2: board, top side]
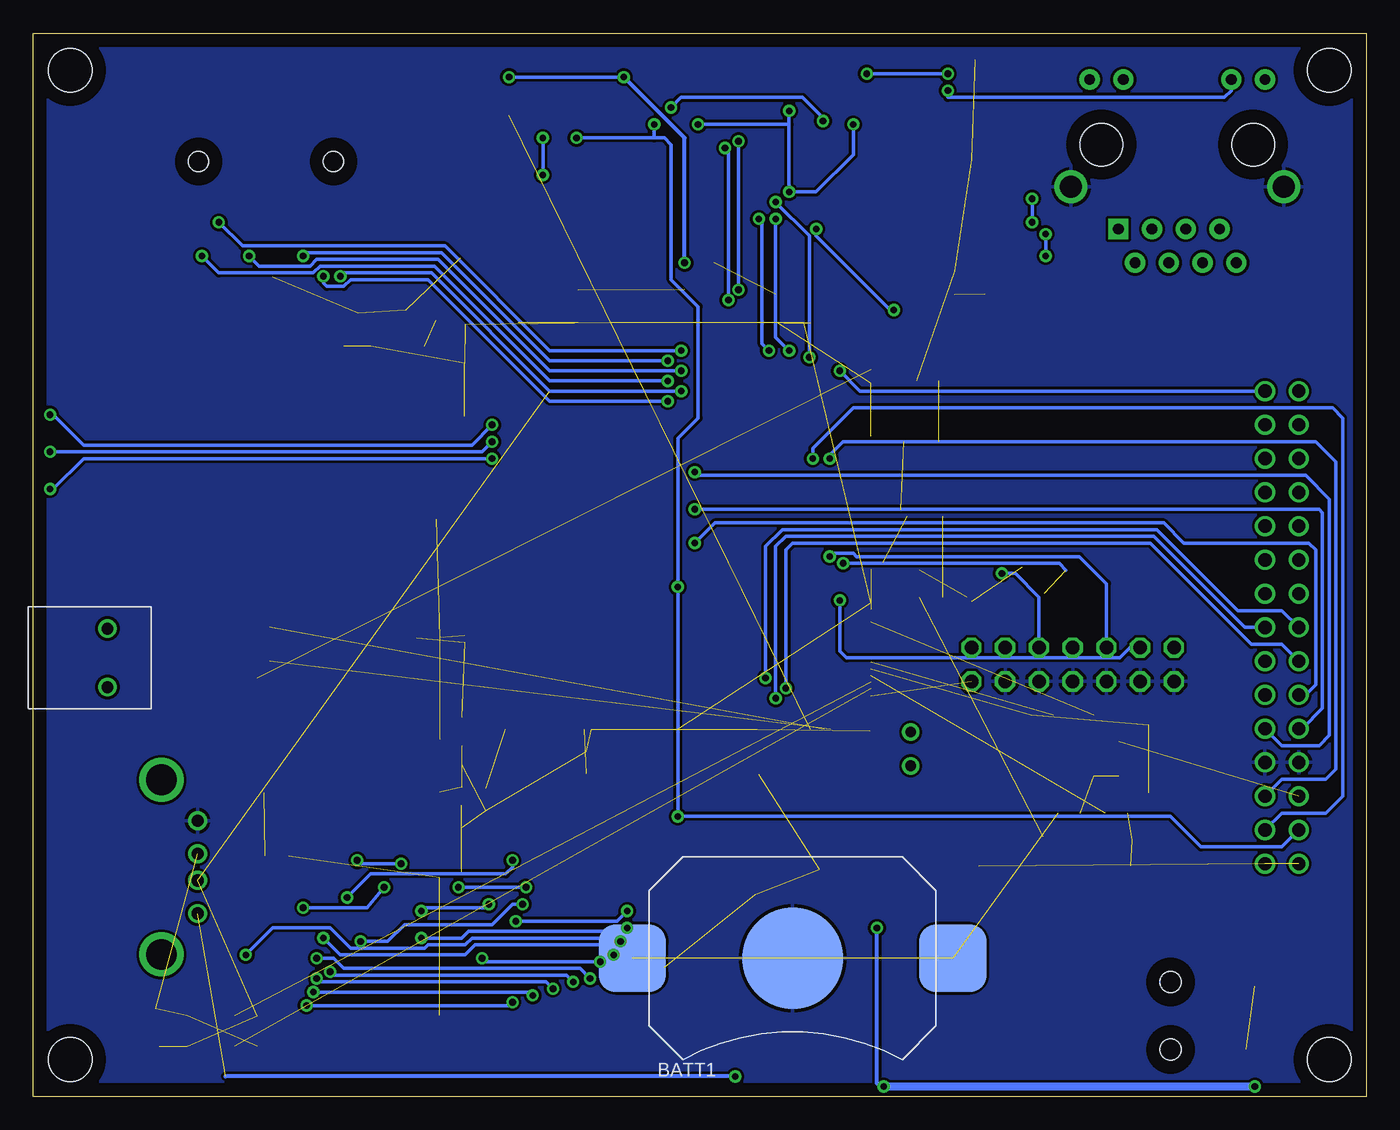
[diagram p3: board, bottom side, seen from below]

Size 100.33 x 80.01 mm. Coordinates in mm from the lower left corner, seen from the top.
Outline: 0,0 100.33,0 100.33,80.01 0,80.01 0,0
Copper layers (1*16): Top 0.035mm / dielectric 1.5mm / Bottom 0.035mm
Design rules "default": minimum track width 10mil, minimum drill 0.6mm, track to track 8mil, track to pad 8mil, pad to pad 8mil, via to via 8mil, smd to smd 8mil, copper to edge 40mil, drill to drill 8mil, minimum pad ring 10mil, minimum via ring 8mil, stop-mask expansion 4mil, vias tented up to drill 0mil, thermal gap 10mil

### Footprints (pad centres in the part's own frame; a part is rotated, then mirrored left to right if it is on the bottom)
2032 = smd 5.08 x 5.08: V1 -12.065,0; V2 12.065,0 | smd 7.62 x 7.62: V- 0,0
0603-CAP = smd 1.1 x 1: 1 -0.85,0; 2 0.85,0
C0603 = smd 1.1 x 1: 1 -0.85,0; 2 0.85,0
C603 = smd 1.1 x 1: 1 -0.85,0; 2 0.85,0
SMC_B = smd 1.6 x 2.4: + -1.5,0; - 1.5,0
CASE_A = smd 2 x 1.5: + 1.3,0; - -1.3,0
SMB = smd 2.4 x 2.4: A 2.2,0; C -2.2,0
0603 = smd 1.1 x 1: 1 -0.85,0; 2 0.85,0
TO263-5 = smd 1.067 x 2.159: 1 -3.404,-5.791; 2 -1.702,-5.791; 3 0,-5.791; 4 1.702,-5.791; 5 3.404,-5.791 | smd 10.8 x 10.41: 6 0,2.54
TSOP54-400 = smd 0.4 x 0.9: 1 -10.4,-5.68; 2 -9.6,-5.68; 3 -8.8,-5.68; 4 -8,-5.68; 5 -7.2,-5.68; 6 -6.4,-5.68; 7 -5.6,-5.68; 8 -4.8,-5.68; 9 -4,-5.68; 10 -3.2,-5.68; 11 -2.4,-5.68; 12 -1.6,-5.68; 13 -0.8,-5.68; 14 0,-5.68; 15 0.8,-5.68; 16 1.6,-5.68; 17 2.4,-5.68; 18 3.2,-5.68; 19 4,-5.68; 20 4.8,-5.68; 21 5.6,-5.68; 22 6.4,-5.68; 23 7.2,-5.68; 24 8,-5.68; 25 8.8,-5.68; 26 9.6,-5.68; 27 10.4,-5.68; 28 10.4,5.68; 29 9.6,5.68; 30 8.8,5.68; 31 8,5.68; 32 7.2,5.68; 33 6.4,5.68; 34 5.6,5.68; 35 4.8,5.68; 36 4,5.68; 37 3.2,5.68; 38 2.4,5.68; 39 1.6,5.68; 40 0.8,5.68; 41 0,5.68; 42 -0.8,5.68; 43 -1.6,5.68; 44 -2.4,5.68; 45 -3.2,5.68; 46 -4,5.68; 47 -4.8,5.68; 48 -5.6,5.68; 49 -6.4,5.68; 50 -7.2,5.68; 51 -8,5.68; 52 -8.8,5.68; 53 -9.6,5.68; 54 -10.4,5.68
SOT23 = smd 1 x 1.4: 1 -0.95,-1.1; 2 0.95,-1.1; 3 0,1.1
MSOP8 = smd 1.2 x 0.35: 1 -2.145,0.975; 2 -2.145,0.325; 3 -2.145,-0.325; 4 -2.145,-0.975; 5 2.145,-0.975; 6 2.145,-0.325; 7 2.145,0.325; 8 2.145,0.975
HR911105A = drill 0.813 pad 1.524 square: 1 4.445,-6.35 | drill 0.813 pad 1.524: 2 3.175,-8.89; 3 1.905,-6.35; 4 0.635,-8.89; 5 -0.635,-6.35; 6 -1.905,-8.89; 7 -3.175,-6.35; 8 -4.445,-8.89; 9 6.604,4.902; 10 4.064,4.902; 11 -4.064,4.902; 12 -6.604,4.902 | drill 1.651 pad 2.159: 13 8.001,-3.175; 14 -8.001,-3.175 | hole 3.2: 5.715,0; -5.715,0
STAND-OFF = hole 3.302: 0,0
WE-KI_0805_B = smd 1.02 x 1.78: 1 -0.89,0; 2 0.89,0
MS85 = smd 4.5 x 2.25: 1 0,-3.383; 2 0,3.383
CHIPLED_0805 = smd 1.2 x 1.2: A 0,-1.05; C 0,1.05
TC26H = drill 0.813: 1 -1.27,0; 2 1.27,0
R0603 = smd 1 x 1.1: 1 -0.85,0; 2 0.85,0
RN8P-4R-CRA06S = smd 0.63 x 1.15: 1 -1.295,-0.975; 4 1.295,-0.975; 5 1.295,0.975; 8 -1.295,0.975 | smd 0.44 x 1.15: 2 -0.4,-0.975; 3 0.4,-0.975; 6 0.4,0.975; 7 -0.4,0.975
SJ_2S-NO = smd 0.635 x 1.27: 1 -0.45,0; 2 0.45,0
MA07-2 = drill 1.016 octagon: 1 -7.62,-1.27; 2 -7.62,1.27; 3 -5.08,-1.27; 4 -5.08,1.27; 5 -2.54,-1.27; 6 -2.54,1.27; 7 0,-1.27; 8 0,1.27; 9 2.54,-1.27; 10 2.54,1.27; 11 5.08,-1.27; 12 5.08,1.27; 13 7.62,-1.27; 14 7.62,1.27
TACT_SWITCH_SMALL = smd 1.651 x 0.762: 1 -2.54,1.905; 2 2.54,1.905; 3 -2.54,-1.905; 4 2.54,-1.905
SO08W = smd 0.6 x 2.2: 1 -1.905,-4.6; 2 -0.635,-4.6; 3 0.635,-4.6; 4 1.905,-4.6; 5 1.905,4.6; 6 0.635,4.6; 7 -0.635,4.6; 8 -1.905,4.6
PQFP208 = smd 1.5 x 0.32: 1 -15.3,12.75; 2 -15.3,12.25; 3 -15.3,11.75; 4 -15.3,11.25; 5 -15.3,10.75; 6 -15.3,10.25; 7 -15.3,9.75; 8 -15.3,9.25; 9 -15.3,8.75; 10 -15.3,8.25; 11 -15.3,7.75; 12 -15.3,7.25; 13 -15.3,6.75; 14 -15.3,6.25; 15 -15.3,5.75; 16 -15.3,5.25; 17 -15.3,4.75; 18 -15.3,4.25; 19 -15.3,3.75; 20 -15.3,3.25; 21 -15.3,2.75; 22 -15.3,2.25; 23 -15.3,1.75; 24 -15.3,1.25; 25 -15.3,0.75; 26 -15.3,0.25; 27 -15.3,-0.25; 28 -15.3,-0.75; 29 -15.3,-1.25; 30 -15.3,-1.75; 31 -15.3,-2.25; 32 -15.3,-2.75; 33 -15.3,-3.25; 34 -15.3,-3.75; 35 -15.3,-4.25; 36 -15.3,-4.75; 37 -15.3,-5.25; 38 -15.3,-5.75; 39 -15.3,-6.25; 40 -15.3,-6.75; 41 -15.3,-7.25; 42 -15.3,-7.75; 43 -15.3,-8.25; 44 -15.3,-8.75; 45 -15.3,-9.25; 46 -15.3,-9.75; 47 -15.3,-10.25; 48 -15.3,-10.75; 49 -15.3,-11.25; 50 -15.3,-11.75; 51 -15.3,-12.25; 52 -15.3,-12.75; 105 15.3,-12.75; 106 15.3,-12.25; 107 15.3,-11.75; 108 15.3,-11.25; 109 15.3,-10.75; 110 15.3,-10.25; 111 15.3,-9.75; 112 15.3,-9.25; 113 15.3,-8.75; 114 15.3,-8.25; 115 15.3,-7.75; 116 15.3,-7.25; 117 15.3,-6.75; 118 15.3,-6.25; 119 15.3,-5.75; 120 15.3,-5.25; 121 15.3,-4.75; 122 15.3,-4.25; 123 15.3,-3.75; 124 15.3,-3.25; 125 15.3,-2.75; 126 15.3,-2.25; 127 15.3,-1.75; 128 15.3,-1.25; 129 15.3,-0.75; 130 15.3,-0.25; 131 15.3,0.25; 132 15.3,0.75; 133 15.3,1.25; 134 15.3,1.75; 135 15.3,2.25; 136 15.3,2.75; 137 15.3,3.25; 138 15.3,3.75; 139 15.3,4.25; 140 15.3,4.75; 141 15.3,5.25; 142 15.3,5.75; 143 15.3,6.25; 144 15.3,6.75; 145 15.3,7.25; 146 15.3,7.75; 147 15.3,8.25; 148 15.3,8.75; 149 15.3,9.25; 150 15.3,9.75; 151 15.3,10.25; 152 15.3,10.75; 153 15.3,11.25; 154 15.3,11.75; 155 15.3,12.25; 156 15.3,12.75 | smd 0.32 x 1.5: 53 -12.75,-15.3; 54 -12.25,-15.3; 55 -11.75,-15.3; 56 -11.25,-15.3; 57 -10.75,-15.3; 58 -10.25,-15.3; 59 -9.75,-15.3; 60 -9.25,-15.3; 61 -8.75,-15.3; 62 -8.25,-15.3; 63 -7.75,-15.3; 64 -7.25,-15.3; 65 -6.75,-15.3; 66 -6.25,-15.3; 67 -5.75,-15.3; 68 -5.25,-15.3; 69 -4.75,-15.3; 70 -4.25,-15.3; 71 -3.75,-15.3; 72 -3.25,-15.3; 73 -2.75,-15.3; 74 -2.25,-15.3; 75 -1.75,-15.3; 76 -1.25,-15.3; 77 -0.75,-15.3; 78 -0.25,-15.3; 79 0.25,-15.3; 80 0.75,-15.3; 81 1.25,-15.3; 82 1.75,-15.3; 83 2.25,-15.3; 84 2.75,-15.3; 85 3.25,-15.3; 86 3.75,-15.3; 87 4.25,-15.3; 88 4.75,-15.3; 89 5.25,-15.3; 90 5.75,-15.3; 91 6.25,-15.3; 92 6.75,-15.3; 93 7.25,-15.3; 94 7.75,-15.3; 95 8.25,-15.3; 96 8.75,-15.3; 97 9.25,-15.3; 98 9.75,-15.3; 99 10.25,-15.3; 100 10.75,-15.3; 101 11.25,-15.3; 102 11.75,-15.3; 103 12.25,-15.3; 104 12.75,-15.3; 157 12.75,15.3; 158 12.25,15.3; 159 11.75,15.3; 160 11.25,15.3; 161 10.75,15.3; 162 10.25,15.3; 163 9.75,15.3; 164 9.25,15.3; 165 8.75,15.3; 166 8.25,15.3; 167 7.75,15.3; 168 7.25,15.3; 169 6.75,15.3; 170 6.25,15.3; 171 5.75,15.3; 172 5.25,15.3; 173 4.75,15.3; 174 4.25,15.3; 175 3.75,15.3; 176 3.25,15.3; 177 2.75,15.3; 178 2.25,15.3; 179 1.75,15.3; 180 1.25,15.3; 181 0.75,15.3; 182 0.25,15.3; 183 -0.25,15.3; 184 -0.75,15.3; 185 -1.25,15.3; 186 -1.75,15.3; 187 -2.25,15.3; 188 -2.75,15.3; 189 -3.25,15.3; 190 -3.75,15.3; 191 -4.25,15.3; 192 -4.75,15.3; 193 -5.25,15.3; 194 -5.75,15.3; 195 -6.25,15.3; 196 -6.75,15.3; 197 -7.25,15.3; 198 -7.75,15.3; 199 -8.25,15.3; 200 -8.75,15.3; 201 -9.25,15.3; 202 -9.75,15.3; 203 -10.25,15.3; 204 -10.75,15.3; 205 -11.25,15.3; 206 -11.75,15.3; 207 -12.25,15.3; 208 -12.75,15.3
48PIN-TQFN = smd 1 x 0.22: P$1 -4,2.75; P$2 -4,2.25; P$3 -4,1.75; P$4 -4,1.25; P$5 -4,0.75; P$6 -4,0.25; P$7 -4,-0.25; P$8 -4,-0.75; P$9 -4,-1.25; P$10 -4,-1.75; P$11 -4,-2.25; P$12 -4,-2.75; P$25 4,-2.75; P$26 4,-2.25; P$27 4,-1.75; P$28 4,-1.25; P$29 4,-0.75; P$30 4,-0.25; P$31 4,0.25; P$32 4,0.75; P$33 4,1.25; P$34 4,1.75; P$35 4,2.25; P$36 4,2.75 | smd 0.22 x 1: P$13 -2.75,-4; P$14 -2.25,-4; P$15 -1.75,-4; P$16 -1.25,-4; P$17 -0.75,-4; P$18 -0.25,-4; P$19 0.25,-4; P$20 0.75,-4; P$21 1.25,-4; P$22 1.75,-4; P$23 2.25,-4; P$24 2.75,-4; P$37 2.75,4; P$38 2.25,4; P$39 1.75,4; P$40 1.25,4; P$41 0.75,4; P$42 0.25,4; P$43 -0.25,4; P$44 -0.75,4; P$45 -1.25,4; P$46 -1.75,4; P$47 -2.25,4; P$48 -2.75,4
POWER_JACK_SMD = smd 2.8 x 2.4: GND 0,-5.7; P$4 6.1,-5.7; VIN0 0,5.7; VIN1 6.1,5.7 | hole 1.6: 0,0; 5.08,0
MICROSD = smd 1.27 x 0.508: 1 0,-7.645; 2 0,-6.553; 3 0,-5.461; 4 0,-4.369; 5 0,-3.277; 6 0,-2.184; 7 0,-1.092; 8 0,0; 9 0,-8.738; 10 0,-9.83 | smd 1.778 x 1.016: RSV1 -7.62,2.286; RSV2 -7.62,-11.938 | hole 1.524: -3.048,-9.906; -3.048,0.254
SOT-23-5 = smd 0.55 x 1.2: 1 -0.95,-1.3; 2 0,-1.3; 3 0.95,-1.3; 4 0.95,1.3; 5 -0.95,1.3
USB-MB-S = smd 2.5 x 0.5: D+ 2.5,0; D- 2.5,0.8; GND 2.5,-1.6; ID 2.5,-0.8; VBUS 2.5,1.6 | smd 2.5 x 2: P$1 -3,-4.5; P$2 -3,4.5; P$3 2.5,-4.4; P$4 2.5,4.5 | drill 0.9: P$5 0,2.2; P$6 0,-2.2
USB-A-H = drill 0.914: D+ 2.718,-1.003; D- 2.718,1.003; GND 2.718,-3.493; VBUS 2.718,3.493 | drill 2.311: P$5 0,-6.566; P$6 0,6.566
5X8 = smd 2.032 x 2.032: 1 -3.429,0; 2 3.429,0
PAK100/2500-30 = drill 1 pad 1.422: 1 -17.78,-1.27; 2 -17.78,1.27; 3 -15.24,-1.27; 4 -15.24,1.27; 5 -12.7,-1.27; 6 -12.7,1.27; 7 -10.16,-1.27; 8 -10.16,1.27; 9 -7.62,-1.27; 10 -7.62,1.27; 11 -5.08,-1.27; 12 -5.08,1.27; 13 -2.54,-1.27; 14 -2.54,1.27; 15 0,-1.27; 16 0,1.27; 17 2.54,-1.27; 18 2.54,1.27; 19 5.08,-1.27; 20 5.08,1.27; 21 7.62,-1.27; 22 7.62,1.27; 23 10.16,-1.27; 24 10.16,1.27; 25 12.7,-1.27; 26 12.7,1.27; 27 15.24,-1.27; 28 15.24,1.27; 29 17.78,-1.27; 30 17.78,1.27

### Placement (x,y rotation side)
BATT1  43.18,10.41 0 bottom
C1  84.33,34.04 0 top
C2  84.33,36.83 0 top
C3  87.88,29.97 180 top
C4  91.69,3.81 0 top
C5  91.95,6.6 0 top
C6  60.2,60.71 0 top
C7  40.64,60.45 180 top
C8  83.57,50.8 270 top
C9  71.37,50.55 0 top
C10  32.77,28.96 0 top
C11  32.77,23.37 0 top
C12  31.75,69.6 270 top
C13  32.77,37.59 180 top
C14  51.82,23.37 270 top
C15  67.82,58.93 90 top
C16  56.9,61.47 90 top
C17  33.02,53.85 180 top
C18  33.02,49.28 180 top
C19  32.77,43.69 180 top
C20  32.77,39.62 180 top
C21  37.34,26.67 270 top
C22  50.29,60.71 180 top
C23  44.45,61.21 90 top
C24  76.71,58.93 0 top
C25  73.15,59.18 0 top
C26  33.78,69.6 270 top
C27  24.38,25.4 270 top
C28  76.96,55.63 270 top
C29  74.93,55.63 270 top
C30  72.9,55.63 270 top
C31  70.87,58.42 180 top
C32  16.76,19.3 0 top
C33  4.06,6.1 90 top
C34  54.86,8.89 90 top
C35  22.35,25.4 90 top
C36  42.16,76.71 90 top
C37  70.87,43.43 0 top
C38  34.54,16.26 90 top
C39  45.97,13.72 270 top
C40  70.61,34.54 0 top
C41  44.2,2.54 90 top
C42  20.57,16.26 270 top
C43  27.69,12.7 0 top
C44  58.67,25.15 270 top
C45  68.07,27.69 270 top
C46  68.07,17.78 270 top
C47  67.31,5.84 0 top
C48  68.07,24.13 90 top
C49  68.07,21.08 270 top
C50  83.82,18.03 180 top
C51  83.82,22.86 180 top
C52  44.7,76.71 90 top
C53  45.72,23.37 270 top
C54  67.82,62.23 90 top
C55  36.58,71.12 180 top
C56  36.58,69.09 180 top
C57  50.29,68.83 180 top
C58  50.29,64.77 0 top
C59  48.26,62.74 180 top
C60  28.7,61.21 90 top
C61  34.54,61.21 270 top
C62  60.2,62.74 180 top
C63  29.21,37.59 180 top
C74  82.3,62.48 90 top
C75  25.15,73.15 90 top
D1  8.38,6.1 90 top
D2  43.18,6.86 0 top
F1  46.23,2.54 90 top
IC1  30.48,5.84 90 top
IC2  75.44,16.51 270 top
IC3  41.15,2.54 90 top
IC4  29.46,16.26 270 top
J4  14.22,71.63 0 top
JP1  97.54,77.22 0 top
JP2  2.79,77.22 0 top
JP3  97.54,2.79 0 top
JP4  2.79,2.79 0 top
L1  30.99,61.21 270 top
L2  29.72,69.6 270 top
L3  36.58,73.15 0 top
L4  50.29,70.87 0 top
L5  41.15,13.72 0 top
LED1  96.77,51.31 90 top
LED2  96.77,48.51 90 top
LED3  96.77,45.72 90 top
LINK/ACT  33.53,76.96 180 top
Q1  34.29,26.16 90 top
Q2  16.76,16.26 180 top
R1  87.63,35.31 180 top
R2  87.88,32.51 180 top
R3  84.33,6.1 0 top
R4  84.33,3.81 0 top
R4A  27.43,73.15 90 top
R5  55.88,74.68 90 top
R5A  31.5,73.15 90 top
R6  66.29,22.35 90 top
R7  87.88,3.81 0 top
R8  87.88,6.1 0 top
R9  50.29,66.8 180 top
R10  27.43,69.6 90 top
R11  84.33,31.5 180 top
R12  84.33,29.21 0 top
R13  86.11,62.48 270 top
R14  32.77,33.53 0 top
R15  36.58,61.21 90 top
R16  92.71,51.31 180 top
R17  92.71,48.51 180 top
R18  64.52,74.68 90 top
R19  21.34,28.7 0 top
R20  70.87,55.63 90 top
R21  24.38,28.7 180 top
R22  92.71,45.72 180 top
R23  22.35,21.34 180 top
R24  25.15,69.6 90 top
R25  32.77,35.56 0 top
R26  26.42,61.21 270 top
R27  52.83,8.89 270 top
R28  24.13,61.21 270 top
R29  34.54,12.7 0 top
R30  18.8,21.34 180 top
R31  83.57,12.45 0 top
R32  26.42,16.26 270 top
R33  23.88,16.26 270 top
R34  25.15,19.56 180 top
R35  33.53,73.15 90 top
R36  29.46,73.15 90 top
RN2  24.64,38.86 0 top
SJ1  64.52,65.28 270 top
SJ3  32.77,31.24 90 top
SJ6  55.88,65.28 270 top
SPEED  29.46,76.96 180 top
SV1  22.1,32.51 180 top
SW1  54.36,3.81 0 top
U1  60.2,70.1 180 top
U2  68.83,70.1 180 top
U3  52.58,42.93 0 top
U$1  43.43,67.82 0 top
U$2  14.73,3.56 90 top
USD  87.63,67.31 270 top
VR1  19.56,25.4 0 top
WAKE  14.48,25.4 90 top
X1  94.74,33.02 180 top
X2  90.68,17.27 180 top
X3  77.72,50.8 0 top
X4  6.35,35.31 90 top

### Tracks (layer width: path | path; a pad name or v marks a point on that pad's centre or on a via)
1.8V  (10 unrouted)
  Top 0.254: U3.203 42.33,59.61 C7.1 | U3.174 56.83,60.55 C16.1 | U3.38 36.23,37.18 35.81,37.59 C13.1 | U3.77 C14.1
  Top 0.61: C42.+ 20.57,19.05 21.08,19.56 R34.2 23.88,19.14 R33.1
3.3V  (via drill 0.51)  (35 unrouted)
  Top 0.254: LINK/ACT.A 33.53,78.23 29.68,78.23 SPEED.A 29.46,78.23 20.83,78.23 | 20.83,78.23 7.87,78.23 7.62,77.98 J4.12 | 20.83,78.23 J4.9 | v64.52,76.71 R18.2 | R5.2 v55.88,76.71 47.75,76.71 44.68,73.64 U$1.P$40 | 83.31,61.72 86.02,61.72 R13.2 | C74.1 82.3,61.72 83.31,61.72 | 83.31,61.72 83.31,67.26 USD.4 | U$1.P$26 48.64,65.57 C58.1 49.53,64.68 49.53,62.74 C59.1 47.43,64.75 U$1.P$25 | U3.199 44.33,59.99 C23.1 | U1.6 59.56,62.95 C62.2 59.44,62.74 59.44,60.79 C6.1 59.33,60.69 U3.169 | U3.13 35.2,49.68 34.8,49.28 C18.1 | U3.24 35.03,44.18 34.54,43.69 C19.1 | U3.32 36.37,40.18 35.81,39.62 C20.1 | C21.1 37.34,30.12 U3.52 | SV1.2 SV1.1 29.72,35.56 | 29.72,35.56 R25.1 | 29.72,35.56 29.72,37.25 C63.1 | U3.132 70.02,43.68 C37.1 | U3.5 34.12,53.68 C17.1 | U3.65 45.83,24.22 C53.1 | RN2.5 RN2.6 RN2.7 RN2.8 | U3.157 65.33,59.69 | U3.160 63.83,59.69 65.33,59.69 | C54.2 65.33,63.08 65.33,59.69 | C54.2 68.2,63.08 | U2.6 68.2,64.77 68.07,64.77 68.07,63.08 C54.2 | IC2.49 82.97,22.91 C51.2 | IC2.1 68.07,26.91 C45.2 68.07,25.4 68.16,25.31 68.4,25.31 | IC2.14 68.07,16.51 C46.2 | IC2.27 68.43,6.11 C47.2 | 68.4,25.31 IC2.3 | C48.2 68.4,25.31 | IC2.9 68.35,20.51 C49.2 | IC2.43 82.89,18.11 C50.2
  Top 0.305: IC1.4 38.02,7.54 38.1,7.62 38.1,17.1 | IC4.3 29.14,17.34 29.46,17.02 34.54,17.02 C38.+ | 49.53,62.74 v51.31,62.74 51.31,60.71 C22.1 51.05,60.62 51.05,59.94 50.33,59.22 U3.187
  Top 0.61: L5.2 38.1,17.1 35,17.1 C38.+
  Bottom 0.254: v55.88,76.71 v64.52,76.71
  Bottom 0.305: v51.31,62.74 51.31,72.14 v55.88,76.71
5V
  Top 0.305: IC3.2 42.35,3.49 42.42,3.56 44.03,3.56 C41.2 44.2,3.56 46.06,3.56 F1.2
CCT  (1 unrouted)
  Top 0.254: J4.5 13.59,64.01 J4.4 17.23,60.36 R28.2 R26.2 C60.1
D0
  Top 0.254: IC2.2 70.31,26.11 70.61,26.42 70.61,28.7 68.64,30.68 U3.106
D1
  Top 0.254: IC2.4 70.48,24.51 71.12,25.15 71.12,28.96 68.9,31.18 U3.107
D2
  Top 0.254: IC2.5 70.7,23.71 71.63,24.64 71.63,29.72 69.67,31.68 U3.108
D3
  Top 0.254: IC2.7 70.37,22.11 72.14,23.88 72.14,29.97 69.93,32.18 U3.109
D4
  Top 0.254: IC2.8 70.33,21.31 72.64,23.62 72.64,30.23 70.19,32.68 U3.110
D5
  Top 0.254: IC2.10 70.51,19.71 73.15,22.35 73.15,30.48 70.46,33.18 U3.111
D6
  Top 0.254: IC2.11 70.47,18.91 73.66,22.1 73.66,30.73 70.72,33.68 U3.112
D7  (via drill 0.51)
  Top 0.254: U3.118 73.56,36.68 75.95,34.29 v75.95,17.78 | IC2.13 72.43,17.31 v72.64,17.53
  Bottom 0.254: v72.64,17.53 75.69,17.53 v75.95,17.78
D8
  Top 0.254: IC2.42 80.48,17.31 76.45,21.34 76.45,34.54 73.82,37.18 U3.119
D9
  Top 0.254: IC2.44 80.4,18.91 76.96,22.35 76.96,34.8 74.08,37.68 U3.120
D10
  Top 0.254: IC2.45 80.37,19.71 77.47,22.61 77.47,35.31 74.6,38.18 U3.121
D11
  Top 0.254: IC2.47 80.54,21.31 77.98,23.88 77.98,35.56 74.86,38.68 U3.122
D12
  Top 0.254: IC2.48 80.51,22.11 78.49,24.13 78.49,35.81 75.12,39.18 U3.123
D13
  Top 0.254: IC2.50 80.43,23.71 78.99,25.15 78.99,36.07 75.39,39.68 U3.124
D14
  Top 0.254: IC2.51 80.65,24.51 79.5,25.65 79.5,36.32 75.65,40.18 U3.125
D15
  Top 0.254: IC2.53 80.32,26.11 80.01,26.42 80.01,36.58 75.91,40.68 U3.126
GND  (11 unrouted)
  Top 0.254: IC2.12 69.01,18.11 68.58,18.54 68.16,18.54 C46.1 | 68.07,26.42 C45.1
  pour Bottom (rank 6): 0,80.01 100.33,80.01 100.33,0 0,0
  pour Top (rank 6): 0,80.01 100.33,80.01 100.33,-1.02 0,-1.02
LED_A
  Top 0.254: R5A.1 R35.1 34.46,72.3 34.54,72.39 34.54,74.93 35.05,75.44 40.13,75.44 43.18,72.39 U$1.P$43
LED_B  (via drill 0.51)
  Top 0.254: R4A.1 R36.1 30.39,72.3 30.48,72.39 30.48,76.71 30.73,76.96 v31.5,76.96 | U$1.P$42 43.68,72.65 39.37,76.96 v37.59,76.96
  Bottom 0.254: v31.5,76.96 v37.59,76.96
LED_SPEED
  Top 0.254: J4.10 18.29,75.44 18.54,75.18 27.18,75.18 27.43,74.93 R4A.2
N$1
  Top 0.254: U3.35 36.14,38.68 36.07,38.61 27.94,38.61 27.18,37.85 | 27.18,37.85 25.97,37.85 RN2.4 | SV1.3 27.18,37.85
N$2
  Top 0.254: Q1.2 34.29,28.96 | 34.29,28.96 34.29,31.75 36.22,33.68 U3.45 | 34.29,28.96 C10.2
N$3
  Top 0.254: U3.46 36.48,33.18 35.81,32.51 35.81,26.42 Q1.1 33.78,24.38 33.78,23.53 C11.2
N$4
  Top 0.254: U3.149 68.73,52.18 69.34,51.56 72.39,51.56 | 72.39,51.56 74.17,51.56 74.17,50.93 X3.1 | C9.2 72.39,50.8 72.39,51.56
N$5
  Top 0.254: U3.150 80.67,52.68 81.03,52.32 81.03,50.93 X3.2 82.72,50.8 C8.2
N$6
  Top 0.254: U3.151 68.67,53.18 69.09,53.59 74.68,53.59 74.93,53.85 C29.2
N$7
  Top 0.254: IC2.18 67.46,13.31 67.06,13.72 67.06,29.97 67.26,30.18 U3.105
N$8  (via drill 0.51)
  Top 0.254: U3.104 65.33,15.19 v66.04,14.48 | IC2.17 70.98,14.11 v71.12,13.97
  Bottom 0.254: v66.04,14.48 66.29,14.22 70.87,14.22 v71.12,13.97
N$9
  Top 0.254: U3.116 72.78,35.68 74.68,33.78 74.68,15.24 74.35,14.91 IC2.16
N$10  (via drill 0.51)
  Top 0.254: U3.99 62.83,26.58 62.99,26.42 62.99,16 v63.25,15.75 | IC2.15 68.36,15.71 v68.33,15.75
  Bottom 0.254: v63.25,15.75 v68.33,15.75
N$11
  Top 0.254: IC2.23 66.64,9.31 62.48,13.46 62.48,26.16 62.33,26.32 U3.98
N$12
  Top 0.254: IC2.24 66.42,8.51 61.98,12.95 61.98,25.91 61.83,26.06 U3.97
N$29  (via drill 0.51)
  Top 0.254: U3.81 53.83,25.67 56.39,23.11 56.39,13.46 v55.63,12.7 | IC2.20 70.89,11.71 v71.12,11.94
  Bottom 0.254: v55.63,12.7 55.88,12.45 67.56,12.45 68.07,11.94 v71.12,11.94
N$30  (via drill 0.51)
  Top 0.254: IC2.21 67.58,10.91 66.55,11.94 65.28,11.94 v64.01,13.21 | U3.80 53.33,25.41 55.88,22.86 55.88,14.22 v55.63,13.97
  Bottom 0.254: v55.63,13.97 56.39,13.21 v64.01,13.21
N$31  (via drill 0.51)
  Top 0.254: U3.115 72.01,35.18 74.17,33.02 74.17,16 v73.91,15.75 | IC2.38 80.12,14.11 v80.01,14.22
  Bottom 0.254: v80.01,14.22 75.18,14.22 v73.91,15.75
N$32
  Top 0.254: IC2.25 66.2,7.71 61.47,12.45 61.47,25.65 61.33,25.79 U3.96
N$33
  Top 0.254: IC2.26 65.99,6.91 60.96,11.94 60.96,25.4 60.83,25.53 U3.95
N$34  (via drill 0.51)  (4 unrouted)
  Top 0.254: U3.191 48.33,55.81 51.05,53.09 v51.56,53.09 | USD.1 79.98,66.27 77.22,63.5 v77.22,61.72
  Bottom 0.254: v51.56,53.09 61.47,53.09 70.36,61.98 76.96,61.98 v77.22,61.72
N$35  (3 unrouted)
N$36  (1 unrouted)
N$37
  Top 0.254: U3.43 36.45,34.68 33.53,31.75 32.82,31.75 SJ3.2
N$38  (1 unrouted)
N$39
  Top 0.254: U3.181 53.33,70.35 53.59,70.61 60.71,70.61 | 60.71,70.61 69.34,70.61 69.47,70.74 U2.2 | U1.2 60.73,74.7 60.71,74.68 60.71,70.61
N$40
  Top 0.305: IC1.5 34.7,9.25 33.78,10.16 33.78,12.61 R29.1 29.97,12.7 29.79,12.88 IC4.7 29.79,11.76 29.72,11.68 19.05,11.68 16.76,13.97 Q2.3
N$41  (via drill 0.51)
  Top 0.254: U3.180 53.83,69.07 54.1,69.34 v61.98,69.34 70.36,69.34 70.74,69.72 U2.1 | U1.1 62,74.7 61.98,74.68 v61.98,72.14
  Bottom 0.254: v61.98,69.34 v61.98,72.14
N$42  (via drill 0.51)
  Top 0.254: C61.2 34.54,60.45 35.56,60.45 | 35.56,60.45 36.49,60.45 | 36.49,60.45 R15.1 36.58,60.45 36.49,60.45 | 35.56,60.45 v35.56,59.18 | U$1.P$16 42.18,64.5 v41.4,65.28
  Bottom 0.254: v35.56,59.18 35.81,59.18 41.4,64.77 v41.4,65.28
N$43
  Top 0.254: X4.18 6.35,39.12 8.89,39.12 14.45,44.68 U3.23
N$44
  Top 0.254: X4.17 8.89,37.85 13.72,42.67 34.29,42.67 34.79,43.18 U3.26
N$45
  Top 0.254: U3.179 54.33,67.79 54.61,68.07 61.98,68.07 | 61.98,68.07 70.36,68.07 70.74,67.69 U2.8 | 61.98,68.07 61.98,65.63 U1.8
N$46
  Top 0.254: U3.9 6.21,51.68 X4.28
N$47  (via drill 0.51)
  Top 0.254: U3.37 39.29,37.68 v39.62,37.34
  Bottom 0.254: SV1.11 17.53,34.04 18.54,33.02 39.12,33.02 39.62,33.53 v39.62,37.34
N$48  (via drill 0.51)
  Top 0.254: U3.30 35.84,41.18 35.31,40.64 27.69,40.64 27.43,40.39 v27.43,39.37 | RN2.3 25.04,35.92 24.64,35.52 SV1.5
  Bottom 0.254: v27.43,39.37 26.42,39.37 24.64,37.59 SV1.5
N$49  (via drill 0.51)  (1 unrouted)
  Top 0.254: U3.31 38.83,40.68 v39.37,40.13 | RN2.2 24.24,35.92 SV1.7
  Bottom 0.254: 22.61,39.62 23.11,40.13 v39.37,40.13
N$50  (via drill 0.51)
  Top 0.254: U3.34 40.19,39.18 40.39,39.37 v40.39,40.64 | RN2.1 23.34,37.57 SV1.9
  Bottom 0.254: v40.39,40.64 40.13,40.89 38.61,40.89 38.35,40.64 21.59,40.64 19.56,38.61 SV1.9
N$51
  Top 0.254: U2.5 66.93,65.66 66.8,65.79 64.57,65.79 SJ1.1
N$52
  Top 0.254: X4.13 8.89,32.77 18.29,42.16 34.54,42.16 35.06,42.68 U3.27
N$53  (via drill 0.51)
  Top 0.254: U3.94 60.33,25.27 60.45,25.15 60.45,10.92 v64.26,7.11 | IC2.29 79.81,6.91 v79.76,6.86
  Bottom 0.254: v64.26,7.11 64.52,6.86 v79.76,6.86
N$54  (via drill 0.51)
  Top 0.254: U3.93 59.83,25.01 59.94,24.89 59.94,10.41 v62.74,7.62 | IC2.30 79.41,7.71 v79.25,7.87
  Bottom 0.254: v62.74,7.62 62.99,7.87 v79.25,7.87
N$55  (via drill 0.51)
  Top 0.254: U3.92 59.33,24.75 59.44,24.64 59.44,9.91 v61.21,8.13 | IC2.31 79.88,8.51 79.5,8.89 v78.99,8.89
  Bottom 0.254: v61.21,8.13 61.72,8.64 78.74,8.64 v78.99,8.89
N$56  (via drill 0.51)
  Top 0.254: U3.89 57.83,25.48 58.93,24.38 58.93,9.4 v59.69,8.64 | IC2.32 80.1,9.31 79.76,9.65 78.23,9.65 v77.98,9.4
  Bottom 0.254: v59.69,8.64 60.2,9.14 77.72,9.14 v77.98,9.4
N$57  (via drill 0.51)
  Top 0.254: U3.88 57.33,25.22 58.42,24.13 v58.42,8.89 | IC2.33 79.3,10.11 v78.99,10.41
  Bottom 0.254: v58.42,8.89 59.18,9.65 76.96,9.65 77.72,10.41 v78.99,10.41
N$58  (via drill 0.51)
  Top 0.254: U3.100 63.33,26.84 63.5,26.67 63.5,17.27 64.26,16.51 64.26,15.24 v63.5,14.48 | IC2.34 79.77,10.91 79.5,11.18 76.2,11.18 v75.69,11.68
  Bottom 0.254: v63.5,14.48 64.26,14.48 65.79,12.95 72.39,12.95 73.66,11.68 v75.69,11.68
N$59  (via drill 0.51)
  Top 0.254: U3.86 56.33,25.46 57.91,23.88 57.91,10.41 v57.66,10.16 | v66.55,10.41 67.56,10.41 67.87,10.11 IC2.22
  Bottom 0.254: v57.66,10.16 66.29,10.16 v66.55,10.41
N$60  (via drill 0.51)
  Top 0.254: U3.85 55.83,25.2 57.4,23.62 57.4,11.43 v56.64,10.67 | IC2.35 78.71,11.71 v78.49,11.94
  Bottom 0.254: v56.64,10.67 57.4,11.43 67.06,11.43 67.82,10.67 77.22,10.67 v78.49,11.94
N$61  (via drill 0.51)
  Top 0.254: U3.84 55.33,24.94 56.9,23.37 56.9,12.45 v56.13,11.68 | v84.33,10.67 84.33,12.36 R31.2
  Bottom 0.254: v56.13,11.68 56.39,11.94 67.31,11.94 67.82,11.43 70.61,11.43 70.87,11.18 76.45,11.18 77.98,12.7 82.3,12.7 v84.33,10.67
N$62
  Top 0.254: IC2.36 81.72,12.51 81.79,12.45 R31.1
N$63  (1 unrouted)
N$64
  Top 0.254: U3.182 52.83,71.12 53.34,71.63 58.17,71.63 58.29,71.75 U1.4 58.29,74.04 58.17,73.91 55.97,73.91 R5.1
N$65
  Top 0.254: X4.11 8.89,30.23 20.32,41.66 34.8,41.66 35.32,42.18 U3.28
N$66
  Top 0.254: R10.2 R24.2 C75.1
N$67
  Top 0.254: U$1.P$8 U$1.P$7 34.29,67.57 33.78,68.07 C26.2 C12.2 29.72,68.75 L2.2
N$68  (2 unrouted)
N$69
  Top 0.254: U$1.P$15 41.68,62.96 42.83,61.82 U3.202
N$70  (via drill 0.51)
  Top 0.254: R9.2 48.77,66.8 48.03,66.07 U$1.P$27 45.75,66.07 v45.72,66.04 | U3.198 44.83,56.26 v44.96,56.13
  Bottom 0.254: v44.96,56.13 45.47,56.64 45.47,65.79 v45.72,66.04
N$71  (via drill 0.51)
  Top 0.254: U3.102 64.33,17.85 v64.26,17.78 | IC2.39 76.78,14.91 v76.71,14.99
  Bottom 0.254: v64.26,17.78 64.26,17.27 64.77,16.76 74.93,16.76 v76.71,14.99
N$72
  Top 0.254: U$1.P$23 45.68,63.28 46.33,62.64 U3.195
N$73
  Top 0.254: U$1.P$22 45.18,63.02 45.83,62.38 U3.196
N$74  (via drill 0.51)
  Top 0.254: U$1.P$29 45.48,67.07 v44.45,66.04 | U3.201 43.33,56.24 v43.43,56.13
  Bottom 0.254: v44.45,66.04 44.45,57.15 v43.43,56.13
N$75
  Top 0.254: U1.5 58.29,65.66 58.17,65.79 55.94,65.79 SJ6.1
N$76  (via drill 0.51)
  Top 0.254: U$1.P$34 46.71,69.57 v44.45,67.31 | v41.91,55.63 42.16,55.37 45.21,55.37 45.72,55.88 45.72,56.9 45.33,57.29 U3.197
  Bottom 0.254: v41.91,55.63 41.91,64.77 v44.45,67.31
N$77  (via drill 0.51)
  Top 0.254: U3.193 47.33,59.27 v48.01,59.94 | v48.26,71.37 48.26,70.36 47.97,70.07 U$1.P$35
  Bottom 0.254: v48.01,59.94 48.01,71.12 v48.26,71.37
N$78  (via drill 0.51)
  Top 0.254: U$1.P$36 47.43,71.69 v47.24,71.88 | U3.194 46.83,60.29 v47.24,60.71
  Bottom 0.254: v47.24,60.71 v47.24,71.88
N$79
  Top 0.254: U3.40 34.91,36.18 34.29,35.56 R25.2
N$80  (via drill 0.51)
  Top 0.254: U3.143 66.96,49.18 v65.79,48.01 | v99.06,45.72 LED3.A
  Bottom 0.254: v99.06,45.72 98.81,45.72 96.52,48.01 v65.79,48.01
N$81
  Top 0.254: SPEED.C R36.2
N$82
  Top 0.254: U3.10 8.25,51.18 X4.27
N$83
  Top 0.254: U3.42 35.68,35.18 34.29,33.78 33.87,33.78 R14.2
N$84  (1 unrouted)
  Top 0.254: IC2.19 66.99,12.51 64.83,14.67 U3.103
N$85
  Top 0.254: U3.117 73.04,36.18 75.18,34.04 75.18,13.97 75.84,13.31 IC2.37
N$86
  Top 0.254: U$1.P$5 U$1.P$4 37.43,69.07 C56.1 C55.1 37.34,71.12 36.07,72.39 36.07,72.77 L3.1
N$87
  Top 0.254: L4.1 49.44,70.1 C57.2 48.77,68.83 48,68.07 U$1.P$31
N$88
  Top 0.254: LINK/ACT.C R35.2
N$89  (via drill 0.51)
  Top 0.254: U$1.P$6 v43.43,68.07 | C52.1 44.7,75.69 43.43,75.69 | 42.16,75.69 C36.1 42.33,75.69 43.43,75.69 | v38.61,73.15 L3.2 | L4.2 51.18,72.26 v50.29,73.15 | v43.43,74.17 43.43,75.69
  Bottom 0.254: 43.43,73.15 v43.43,68.07 41.4,68.07 38.61,70.86 v38.61,73.15 | 43.43,73.15 v43.43,74.17 | 43.43,73.15 v50.29,73.15
N$90  (via drill 0.51)
  Top 0.254: U3.144 66.19,49.68 v65.79,49.28 | v99.06,48.51 LED2.A
  Bottom 0.254: v65.79,49.28 66.55,48.51 v99.06,48.51
N$91  (2 unrouted)
N$92  (via drill 0.51)
  Top 0.254: v31.5,75.69 R5A.2
  Bottom 0.254: J4.11 10.16,75.69 10.67,75.18 31.5,75.18 v31.5,75.69
N$94  (via drill 0.51)
  Top 0.254: U3.145 66.16,50.18 v65.79,50.55 | v99.06,51.31 LED1.A
  Bottom 0.254: v65.79,50.55 67.31,49.02 96.52,49.02 98.81,51.31 v99.06,51.31
N$95
  Top 0.254: R16.1 LED1.C
N$96  (1 unrouted)
  Top 0.254: C1.2 86.36,34.04 87.03,33.36 R2.2 arc90 86.78,32.77 82.55,32.77
N$97  (1 unrouted)
  Top 0.254: 82.55,35.31 85.18,35.31 | 85.18,35.31 C2.2 | 85.18,35.31 R1.2
N$98
  Top 0.254: R17.1 LED2.C
N$99
  Top 0.254: X1.D- 88.73,32.22 R2.1
N$100
  Top 0.254: X1.D+ 90.77,33.02 R1.1
N$101
  Top 0.254: R22.1 LED3.C
N$102
  Top 0.254: 87.03,31.42 X1.VBUS | R11.1 85.25,31.42 87.03,31.42 | 87.03,31.42 C3.2
N$103
  Top 0.254: U3.11 9.78,50.68 8.38,49.28 6.35,49.28 X4.26
N$104
  Top 0.254: X4.25 8.64,48.01 10.81,50.18 U3.12
N$105  (via drill 0.51)
  Top 0.305: v36.83,12.7 R29.2
  Top 0.61: v8.38,0.76 D1.C 8.38,4.57 4.09,4.57 C33.+ | IC3.3 36.37,2.54 IC1.1 36.32,2.39 v36.32,0.76
  Bottom 0.305: v36.32,0.76 36.58,0.76 36.83,1.02 v36.83,12.7
  Bottom 0.61: v8.38,0.76 v36.32,0.76
N$106  (2 unrouted)
N$107  (via drill 0.51)
  Top 0.254: U3.190 48.83,56.07 51.05,53.85 v52.58,53.85 | v87.63,63.25 USD.8
  Bottom 0.254: v52.58,53.85 61.47,53.85 70.1,62.48 78.74,62.48 79.25,61.98 86.36,61.98 v87.63,63.25
N$108
  Top 0.254: X4.24 6.35,46.74 8.89,46.74 10.41,48.26 34.54,48.26 34.96,48.68 U3.15
N$109
  Top 0.254: X4.23 8.89,45.47 11.18,47.75 34.8,47.75 35.22,48.18 U3.16
N$110
  Top 0.254: X4.22 6.35,44.2 8.64,44.2 11.68,47.24 35.05,47.24 35.48,47.68 U3.17
N$111
  Top 0.254: X4.21 8.89,42.93 12.7,46.74 35.31,46.74 35.75,47.18 U3.18
N$112
  Top 0.254: X4.20 6.35,41.66 8.89,41.66 13.46,46.23 35.56,46.23 36.01,46.68 U3.19
N$113
  Top 0.254: X4.19 8.89,40.39 14.22,45.72 35.81,45.72 36.27,46.18 U3.20
N$114  (via drill 0.51)
  Top 0.254: U3.158 64.83,45.52 63.5,44.2 v50.55,44.2
  Bottom 0.254: X4.10 4.83,27.69 3.3,29.21 3.3,43.94 3.56,44.2 v50.55,44.2
N$115  (via drill 0.51)
  Top 0.254: U3.159 64.33,48.07 63.25,46.99 v50.55,46.99
  Bottom 0.254: X4.9 6.35,26.42 3.56,26.42 2.79,27.18 2.79,44.96 4.57,46.74 50.29,46.74 v50.55,46.99
N$116  (via drill 0.51)
  Top 0.254: U3.21 38.56,45.68 40.39,47.5 v40.39,48.01
  Bottom 0.254: v40.39,48.01 40.39,48.26 39.37,49.28 3.81,49.28 2.29,47.75 2.29,24.64 3.05,23.88 6.35,23.88 X4.5
N$117  (via drill 0.51)
  Top 0.254: U3.22 39.33,45.18 41.66,47.5 v41.66,48.01
  Bottom 0.254: v41.66,48.01 41.66,48.77 38.61,51.82 2.54,51.82 1.78,51.05 1.78,22.61 3.05,21.34 6.35,21.34 X4.3
N$118  (via drill 0.51)
  Top 0.254: U3.62 44.33,29.84 v44.45,29.97
  Bottom 0.254: X4.15 9.14,35.31 16,42.16 43.69,42.16 44.45,41.4 v44.45,29.97
N$119  (1 unrouted)
N$120
  Top 0.254: U3.154 68.65,54.68 69.09,55.12 70.52,55.12 R20.1 70.87,55.12 72.56,55.12 C30.2
N$121  (via drill 0.51)  (1 unrouted)
  Top 0.305: F1.1 46.23,1.52 v47.5,1.52
  Bottom 0.305: v47.5,1.52 85.85,1.52
N$122  (via drill 0.51)
  Top 0.254: v43.69,30.73 46.23,30.73 46.83,30.13 U3.67
  Bottom 0.254: X4.14 6.35,34.04 8.64,34.04 16.26,41.66 43.18,41.66 43.69,41.15 v43.69,30.73
N$123  (via drill 0.51)
  Top 0.254: v45.21,31.5 43.18,31.5 42.83,31.14 U3.59
  Bottom 0.254: X4.16 6.35,36.58 9.65,36.58 15.75,42.67 43.94,42.67 45.21,41.4 v45.21,31.5
N$124  (via drill 0.51)
  Top 0.254: U3.127 51.03,41.18 v50.55,41.66
  Bottom 0.254: X4.12 4.57,30.23 3.81,30.99 3.81,41.15 4.32,41.66 13.72,41.66 15.24,43.18 49.02,43.18 v50.55,41.66
N$125
  Top 0.254: U3.29 35.58,41.68 35.05,41.15 21.34,41.15 14.48,34.29 SV1.13
N$126  (1 unrouted)
  Top 0.61: 15.75,8.38 8.47,8.38 D1.A
N$127
  Top 0.61: IC1.2 40.21,4.14 40.89,4.83 40.89,6.77 D2.C 40.98,9.91 L5.1
N$130
  Top 0.305: IC4.6 29.14,13.3 C43.2
N$131
  Top 0.305: IC4.5 27.32,14.11 26.92,13.72 26.92,12.79 C43.1
N$132
  Top 0.305: IC4.8 30.44,15.03 29.97,15.49 26.5,15.49 R32.2 26.42,15.49 23.96,15.49 R33.2
N$134
  Top 0.254: IC4.1 30.44,19.34 30.23,19.56 R34.1
N$164  (3 unrouted)
NRST  (via drill 0.51)
  Top 0.254: U2.3 68.2,77.34 68.07,77.47 59.69,77.47 59.69,74.93 59.56,74.8 U1.3 59.46,74.7 59.44,74.68 v59.44,72.14 | SW1.1 53.47,5.71 53.85,6.1 53.85,7.87 | 53.85,7.87 54.7,7.87 C34.1 | 53.85,7.87 53,7.87 | 53,7.87 R27.2 52.83,7.87 53,7.87 | 53.85,7.87 53.85,19.05 v51.82,21.08 | U3.36 39.19,38.18 39.37,38.35 v51.82,38.35 | U$1.P$47 41.18,73.12 v40.89,73.41 | v53.59,73.15 v52.32,74.42
  Bottom 0.254: 53.59,72.14 52.83,72.14 52.32,71.63 52.32,61.47 50.29,59.44 50.29,51.05 51.82,49.53 v51.82,38.35 v51.82,21.08 14.73,21.08 12.45,18.8 6.35,18.8 X4.4 | 53.59,72.14 v59.44,72.14 | v40.89,73.41 40.89,73.66 42.42,75.18 51.56,75.18 v52.32,74.42 | 53.59,72.14 v53.59,73.15
RD+  (via drill 0.51)
  Top 0.254: J4.3 16.13,65.66 17.02,66.55 19.81,66.55 20.57,65.79 v25.15,65.79 38.61,65.79 38.89,66.07 U$1.P$10 | v25.15,67.56 R24.1
  Bottom 0.254: v25.15,65.79 v25.15,67.56
RD-
  Top 0.254: J4.6 12.32,65.91 13.46,67.06 20.32,67.06 20.81,66.57 27.43,66.57 | 27.43,66.57 U$1.P$9 | 27.43,66.57 R10.1
SDCLK  (via drill 0.51)
  Top 0.254: U3.189 49.33,56.34 51.05,54.61 v51.56,54.61 | USD.5 84.35,63.52 v84.07,63.25 86.11,63.25 R13.1
  Bottom 0.254: v51.56,54.61 61.47,54.61 69.85,62.99 78.99,62.99 79.5,62.48 83.31,62.48 v84.07,63.25
SDCS  (via drill 0.51)
  Top 0.254: U3.192 47.83,55.55 51.05,52.32 v52.58,52.32 | USD.2 81.08,65.84 78.49,63.25 v78.49,61.72
  Bottom 0.254: v52.58,52.32 61.47,52.32 70.61,61.47 76.45,61.47 76.96,60.96 78.23,60.96 78.49,61.21 v78.49,61.72
SDMISO  (via drill 0.51)
  Top 0.254: U3.185 51.33,56.37 v51.56,56.13 | USD.7 86.54,65.96 v86.36,65.79
  Bottom 0.254: v51.56,56.13 61.47,56.13 69.34,64.01 84.58,64.01 v86.36,65.79
SDMOSI  (via drill 0.51)
  Top 0.254: U3.186 50.83,55.6 51.05,55.37 v52.58,55.37 | USD.3 82.17,65.41 v80.01,63.25
  Bottom 0.254: v52.58,55.37 61.47,55.37 69.6,63.5 79.76,63.5 v80.01,63.25
SHDN  (1 unrouted)
SPI0_CS1  (1 unrouted)
  Top 0.254: U2.4 66.93,74.3 66.8,74.17 66.8,73.91 64.6,73.91 R18.1
TD+  (via drill 0.51)
  Top 0.254: v24.13,63.25 R28.1 | U$1.P$12 38.91,65.07 38.73,64.9 v24.13,64.9 19.05,64.9 J4.1 18.92,65.02
  Bottom 0.254: v24.13,64.9 v24.13,63.25
TD-
  Top 0.254: U$1.P$11 40.1,65.57 40.39,65.28 40.39,64.77 39.75,64.14 26.42,64.14 | 26.42,64.14 20.83,64.14 19.43,62.74 J4.2 | 26.42,64.14 R26.1
TWCK
  Top 0.254: U3.1 7.67,55.68 X4.30
TWD  (via drill 0.51)
  Top 0.254: U3.208 39.83,54.81 v39.62,54.61
  Bottom 0.254: X4.29 38.1,53.09 v39.62,54.61
USBDETECT  (1 unrouted)
  Top 0.254: R12.1 83.57,29.21 83.57,31.5 R11.2
VDDBU  (2 unrouted)
  Top 0.254: R19.2 R21.2 23.37,28.54 23.37,27.69 | C27.1 24.38,26.42 23.37,26.42 | C35.2 22.52,26.42 23.37,26.42 | 23.37,27.69 23.37,26.42 | VR1.5 18.61,27.5 18.8,27.69 23.37,27.69